# EAGLE design PlingPlong (EAGLE 6.4)

## Sheet 1 of 3
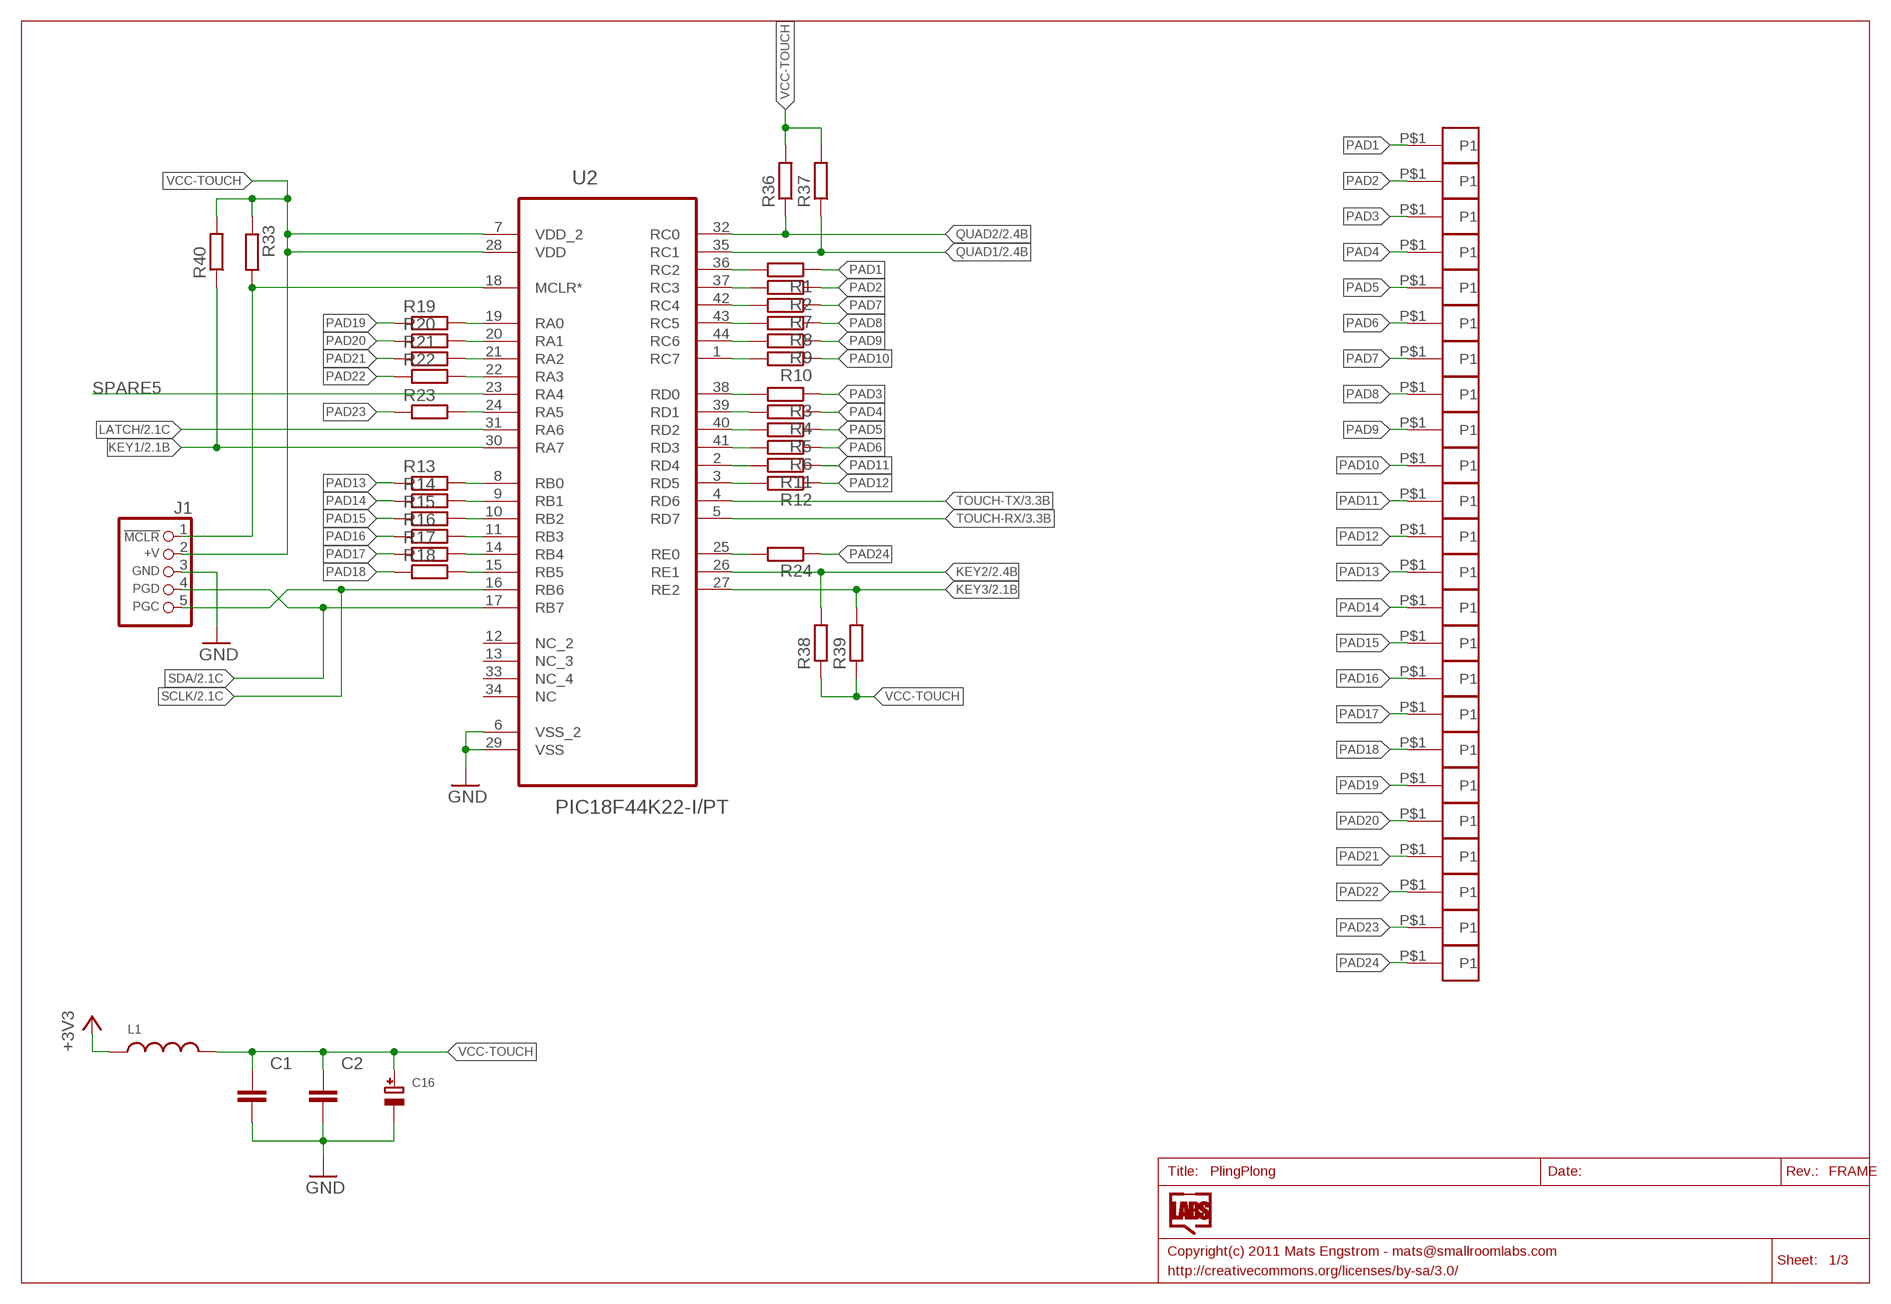
[diagram p0: schematic, sheet 1]

### Parts
C1  CAPACITOR_NPOL-0805  [C805]
C2  CAPACITOR_NPOL-0805  [C805]
C16  CAP_TANTALUMD/7343_WAVE  [EIA7343-31/D-W]
J1  CON_HEADER_PRG_PIC_ICSPB  [HEADER_PRG_1X05_ICSP_B]
L1  INDUCTOR0805  [0805]
P1  PAD-NOSTOP  [PAD1X1NOSTOP]
P2  PAD-NOSTOP  [PAD1X1NOSTOP]
P3  PAD-NOSTOP  [PAD1X1NOSTOP]
P4  PAD-NOSTOP  [PAD1X1NOSTOP]
P5  PAD-NOSTOP  [PAD1X1NOSTOP]
P6  PAD-NOSTOP  [PAD1X1NOSTOP]
P7  PAD-NOSTOP  [PAD1X1NOSTOP]
P8  PAD-NOSTOP  [PAD1X1NOSTOP]
P9  PAD-NOSTOP  [PAD1X1NOSTOP]
P10  PAD-NOSTOP  [PAD1X1NOSTOP]
P11  PAD-NOSTOP  [PAD1X1NOSTOP]
P12  PAD-NOSTOP  [PAD1X1NOSTOP]
P13  PAD-NOSTOP  [PAD1X1NOSTOP]
P14  PAD-NOSTOP  [PAD1X1NOSTOP]
P15  PAD-NOSTOP  [PAD1X1NOSTOP]
P16  PAD-NOSTOP  [PAD1X1NOSTOP]
P17  PAD-NOSTOP  [PAD1X1NOSTOP]
P18  PAD-NOSTOP  [PAD1X1NOSTOP]
P19  PAD-NOSTOP  [PAD1X1NOSTOP]
P20  PAD-NOSTOP  [PAD1X1NOSTOP]
P21  PAD-NOSTOP  [PAD1X1NOSTOP]
P22  PAD-NOSTOP  [PAD1X1NOSTOP]
P23  PAD-NOSTOP  [PAD1X1NOSTOP]
P24  PAD-NOSTOP  [PAD1X1NOSTOP]
R1  R-EU_R0805W  [R0805W]
R2  R-EU_R0805W  [R0805W]
R3  R-EU_R0805W  [R0805W]
R4  R-EU_R0805W  [R0805W]
R5  R-EU_R0805W  [R0805W]
R6  R-EU_R0805W  [R0805W]
R7  R-EU_R0805W  [R0805W]
R8  R-EU_R0805W  [R0805W]
R9  R-EU_R0805W  [R0805W]
R10  R-EU_R0805W  [R0805W]
R11  R-EU_R0805W  [R0805W]
R12  R-EU_R0805W  [R0805W]
R13  R-EU_R0805W  [R0805W]
R14  R-EU_R0805W  [R0805W]
R15  R-EU_R0805W  [R0805W]
R16  R-EU_R0805W  [R0805W]
R17  R-EU_R0805W  [R0805W]
R18  R-EU_R0805W  [R0805W]
R19  R-EU_R0805W  [R0805W]
R20  R-EU_R0805W  [R0805W]
R21  R-EU_R0805W  [R0805W]
R22  R-EU_R0805W  [R0805W]
R23  R-EU_R0805W  [R0805W]
R24  R-EU_R0805W  [R0805W]
R33  R-EU_R0805W  [R0805W]
R36  R-EU_R0805W  [R0805W]
R37  R-EU_R0805W  [R0805W]
R38  R-EU_R0805W  [R0805W]
R39  R-EU_R0805W  [R0805W]
R40  R-EU_R0805W  [R0805W]
U2  PIC18F44K22-I/PT  [QFP80P1200X1200X120-44N]

### Nets
+3V3: L1.1 ; also sheet 2,3
GND: C1.2 C2.2 C16.- J1.3(GND) U2.6(VSS_2) U2.29(VSS) ; also sheet 2,3
KEY1: R40.1 U2.30(RA7) ; also sheet 2
KEY2: R38.2 U2.26(RE1) ; also sheet 2
KEY3: R39.2 U2.27(RE2) ; also sheet 2
LATCH: U2.31(RA6) ; also sheet 2
N$1: R13.2 U2.8(RB0)
N$2: R14.2 U2.9(RB1)
N$3: R15.2 U2.10(RB2)
N$4: R16.2 U2.11(RB3)
N$5: R17.2 U2.14(RB4)
N$6: R18.2 U2.15(RB5)
N$7: R23.2 U2.24(RA5)
N$8: R19.2 U2.19(RA0)
N$9: R20.2 U2.20(RA1)
N$10: R21.2 U2.21(RA2)
N$11: R22.2 U2.22(RA3)
N$14: R1.2 U2.36(RC2)
N$15: R2.2 U2.37(RC3)
N$16: R7.2 U2.42(RC4)
N$17: R8.2 U2.43(RC5)
N$18: R9.2 U2.44(RC6)
N$19: R10.2 U2.1(RC7)
N$20: R24.2 U2.25(RE0)
N$22: J1.1(/MCLR) R33.2 U2.18(MCLR*)
N$23: R12.2 U2.3(RD5)
N$24: R11.2 U2.2(RD4)
N$25: R6.2 U2.41(RD3)
N$26: R5.2 U2.40(RD2)
N$27: R4.2 U2.39(RD1)
N$28: R3.2 U2.38(RD0)
PAD1: P1.P$1(P1) R1.1
PAD2: P2.P$1(P1) R2.1
PAD3: P3.P$1(P1) R3.1
PAD4: P4.P$1(P1) R4.1
PAD5: P5.P$1(P1) R5.1
PAD6: P6.P$1(P1) R6.1
PAD7: P7.P$1(P1) R7.1
PAD8: P8.P$1(P1) R8.1
PAD9: P9.P$1(P1) R9.1
PAD10: P10.P$1(P1) R10.1
PAD11: P11.P$1(P1) R11.1
PAD12: P12.P$1(P1) R12.1
PAD13: P13.P$1(P1) R13.1
PAD14: P14.P$1(P1) R14.1
PAD15: P15.P$1(P1) R15.1
PAD16: P16.P$1(P1) R16.1
PAD17: P17.P$1(P1) R17.1
PAD18: P18.P$1(P1) R18.1
PAD19: P19.P$1(P1) R19.1
PAD20: P20.P$1(P1) R20.1
PAD21: P21.P$1(P1) R21.1
PAD22: P22.P$1(P1) R22.1
PAD23: P23.P$1(P1) R23.1
PAD24: P24.P$1(P1) R24.1
QUAD1: R37.1 U2.35(RC1) ; also sheet 2
QUAD2: R36.1 U2.32(RC0) ; also sheet 2
SCLK: J1.5(PGC) U2.16(RB6) ; also sheet 2
SDA: J1.4(PGD) U2.17(RB7) ; also sheet 2
SPARE5: U2.23(RA4)
TOUCH-RX: U2.5(RD7) ; also sheet 3
TOUCH-TX: U2.4(RD6) ; also sheet 3
VCC-TOUCH: C1.1 C2.1 C16.+ J1.2(+V) L1.2 R33.1 R36.2 R37.2 R38.1 R39.1 R40.2 U2.7(VDD_2) U2.28(VDD)
Unconnected: U2.12(NC_2) U2.13(NC_3) U2.33(NC_4) U2.34(NC)

## Sheet 2 of 3
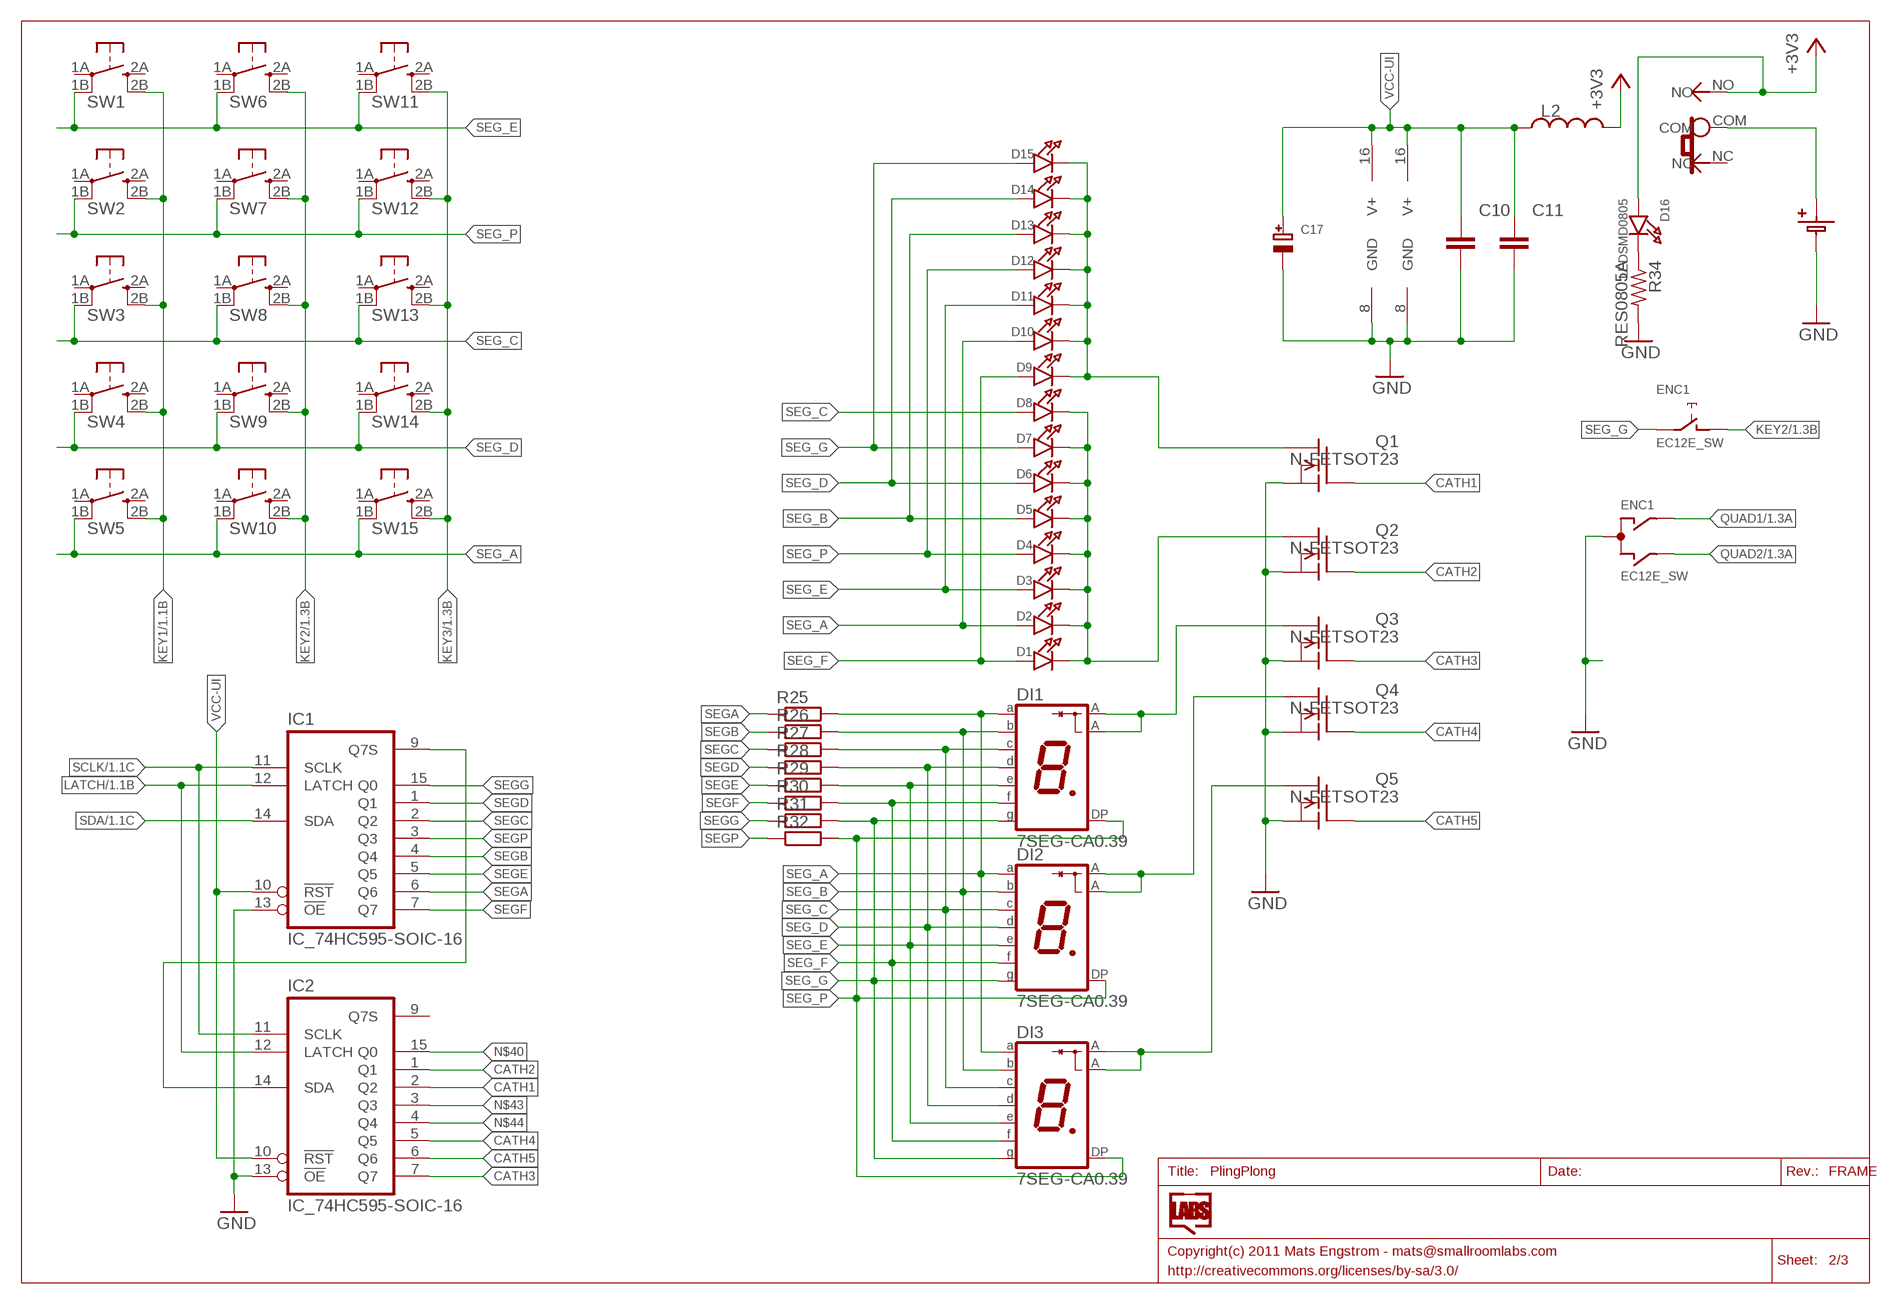
[diagram p1: schematic, sheet 2]

### Parts
BA1  BATTERY1-123PIN  [BATTERY-CR123A-PINS]
C10  CAPACITOR_NPOL-0805  [C805]
C11  CAPACITOR_NPOL-0805  [C805]
C17  CAP_TANTALUMD/7343_WAVE  [EIA7343-31/D-W]
D1  LED3MM  [LED3MM]
D2  LED3MM  [LED3MM]
D3  LED3MM  [LED3MM]
D4  LED3MM  [LED3MM]
D5  LED3MM  [LED3MM]
D6  LED3MM  [LED3MM]
D7  LED3MM  [LED3MM]
D8  LED3MM  [LED3MM]
D9  LED3MM  [LED3MM]
D10  LED3MM  [LED3MM]
D11  LED3MM  [LED3MM]
D12  LED3MM  [LED3MM]
D13  LED3MM  [LED3MM]
D14  LED3MM  [LED3MM]
D15  LED3MM  [LED3MM]
D16  LEDSMD0805  [CHIPLED_0805]
DI1  7SEG-CA0.39  [LG3911]
DI2  7SEG-CA0.39  [LG3911]
DI3  7SEG-CA0.39  [LG3911]
ENC1  EC12E_SW  [ALPS_EC12E_SW]
IC1  IC_74HC595-SOIC-16  [SOIC-16]
IC2  IC_74HC595-SOIC-16  [SOIC-16]
L2  INDUCTOR0805  [0805]
Q1  N-FETSOT23  [SOT23]
Q2  N-FETSOT23  [SOT23]
Q3  N-FETSOT23  [SOT23]
Q4  N-FETSOT23  [SOT23]
Q5  N-FETSOT23  [SOT23]
R25  R-EU_R0805W  [R0805W]
R26  R-EU_R0805W  [R0805W]
R27  R-EU_R0805W  [R0805W]
R28  R-EU_R0805W  [R0805W]
R29  R-EU_R0805W  [R0805W]
R30  R-EU_R0805W  [R0805W]
R31  R-EU_R0805W  [R0805W]
R32  R-EU_R0805W  [R0805W]
R34  RES0805A  [R0805A]
SW1  TACTILETACT-6X6-PTH  [TACTILE-PTH]
SW2  TACTILETACT-6X6-PTH  [TACTILE-PTH]
SW3  TACTILETACT-6X6-PTH  [TACTILE-PTH]
SW4  TACTILETACT-6X6-PTH  [TACTILE-PTH]
SW5  TACTILETACT-6X6-PTH  [TACTILE-PTH]
SW6  TACTILETACT-6X6-PTH  [TACTILE-PTH]
SW7  TACTILETACT-6X6-PTH  [TACTILE-PTH]
SW8  TACTILETACT-6X6-PTH  [TACTILE-PTH]
SW9  TACTILETACT-6X6-PTH  [TACTILE-PTH]
SW10  TACTILETACT-6X6-PTH  [TACTILE-PTH]
SW11  TACTILETACT-6X6-PTH  [TACTILE-PTH]
SW12  TACTILETACT-6X6-PTH  [TACTILE-PTH]
SW13  TACTILETACT-6X6-PTH  [TACTILE-PTH]
SW14  TACTILETACT-6X6-PTH  [TACTILE-PTH]
SW15  TACTILETACT-6X6-PTH  [TACTILE-PTH]
SW16  SLIDESWITCH-PCM12  [PCM12]

### Nets
+3V3: D16.A L2.2 SW16.NO ; also sheet 1,3
CATH1: IC2.2(Q2) Q1.1(G)
CATH2: IC2.1(Q1) Q2.1(G)
CATH3: IC2.7(Q7) Q3.1(G)
CATH4: IC2.5(Q5) Q4.1(G)
CATH5: IC2.6(Q6) Q5.1(G)
CATH_1: D9.C D10.C D11.C D12.C D13.C D14.C D15.C Q1.3(D)
CATH_2: D1.C D2.C D3.C D4.C D5.C D6.C D7.C D8.C Q2.3(D)
CATH_3: DI1.P$3(A) DI1.P$8(A) Q3.3(D)
CATH_4: DI2.P$3(A) DI2.P$8(A) Q4.3(D)
CATH_5: DI3.P$3(A) DI3.P$8(A) Q5.3(D)
GND: BA1.NEG C10.2 C11.2 C17.- ENC1.C IC1.8(GND) IC1.13(!OE) IC2.8(GND) IC2.13(!OE) Q1.2(S) Q2.2(S) Q3.2(S) Q4.2(S) Q5.2(S) R34.2 ; also sheet 1,3
KEY1: SW1.2B SW2.2B SW3.2B SW4.2B SW5.2B ; also sheet 1
KEY2: ENC1.D SW6.2B SW7.2B SW8.2B SW9.2B SW10.2B ; also sheet 1
KEY3: SW11.2B SW12.2B SW13.2B SW14.2B SW15.2B ; also sheet 1
LATCH: IC1.12(LATCH) IC2.12(LATCH) ; also sheet 1
N$31: IC1.9(Q7S) IC2.14(SDA)
N$33: BA1.POS(POS1) SW16.COM
N$34: D16.C R34.1
N$40: IC2.15(Q0)
N$43: IC2.3(Q3)
N$44: IC2.4(Q4)
QUAD1: ENC1.A ; also sheet 1
QUAD2: ENC1.B ; also sheet 1
SCLK: IC1.11(SCLK) IC2.11(SCLK) ; also sheet 1
SDA: IC1.14(SDA) ; also sheet 1
SEG_A: D2.A D10.A DI1.P$10(A) DI2.P$10(A) DI3.P$10(A) R25.2 SW5.1B SW10.1B SW15.1B
SEG_B: D5.A D13.A DI1.P$9(B) DI2.P$9(B) DI3.P$9(B) R26.2
SEG_C: D8.A DI1.P$7(C) DI2.P$7(C) DI3.P$7(C) R27.2 SW3.1B SW8.1B SW13.1B
SEG_D: D6.A D14.A DI1.P$5(D) DI2.P$5(D) DI3.P$5(D) R28.2 SW4.1B SW9.1B SW14.1B
SEG_E: D3.A D11.A DI1.P$2(E) DI2.P$2(E) DI3.P$2(E) R29.2 SW1.1B SW6.1B SW11.1B
SEG_F: D1.A D9.A DI1.P$1(F) DI2.P$1(F) DI3.P$1(F) R30.2
SEG_G: D7.A D15.A DI1.P$6(G) DI2.P$6(G) DI3.P$6(G) ENC1.E R31.2
SEG_P: D4.A D12.A DI1.P$4(DP) DI2.P$4(DP) DI3.P$4(DP) R32.2 SW2.1B SW7.1B SW12.1B
SEGA: IC1.6(Q6) R25.1
SEGB: IC1.4(Q4) R26.1
SEGC: IC1.2(Q2) R27.1
SEGD: IC1.1(Q1) R28.1
SEGE: IC1.5(Q5) R29.1
SEGF: IC1.7(Q7) R30.1
SEGG: IC1.15(Q0) R31.1
SEGP: IC1.3(Q3) R32.1
VCC-UI: C10.1 C11.1 C17.+ IC1.10(!RST) IC1.16(V+) IC2.10(!RST) IC2.16(V+) L2.1
Unconnected: ENC1.GND1(G) ENC1.GND2(G) IC2.9(Q7S) SW1.1A SW1.2A SW2.1A SW2.2A SW3.1A SW3.2A SW4.1A SW4.2A SW5.1A SW5.2A SW6.1A SW6.2A SW7.1A SW7.2A SW8.1A SW8.2A SW9.1A SW9.2A SW10.1A SW10.2A SW11.1A SW11.2A SW12.1A SW12.2A SW13.1A SW13.2A SW14.1A SW14.2A SW15.1A SW15.2A SW16.NC

## Sheet 3 of 3
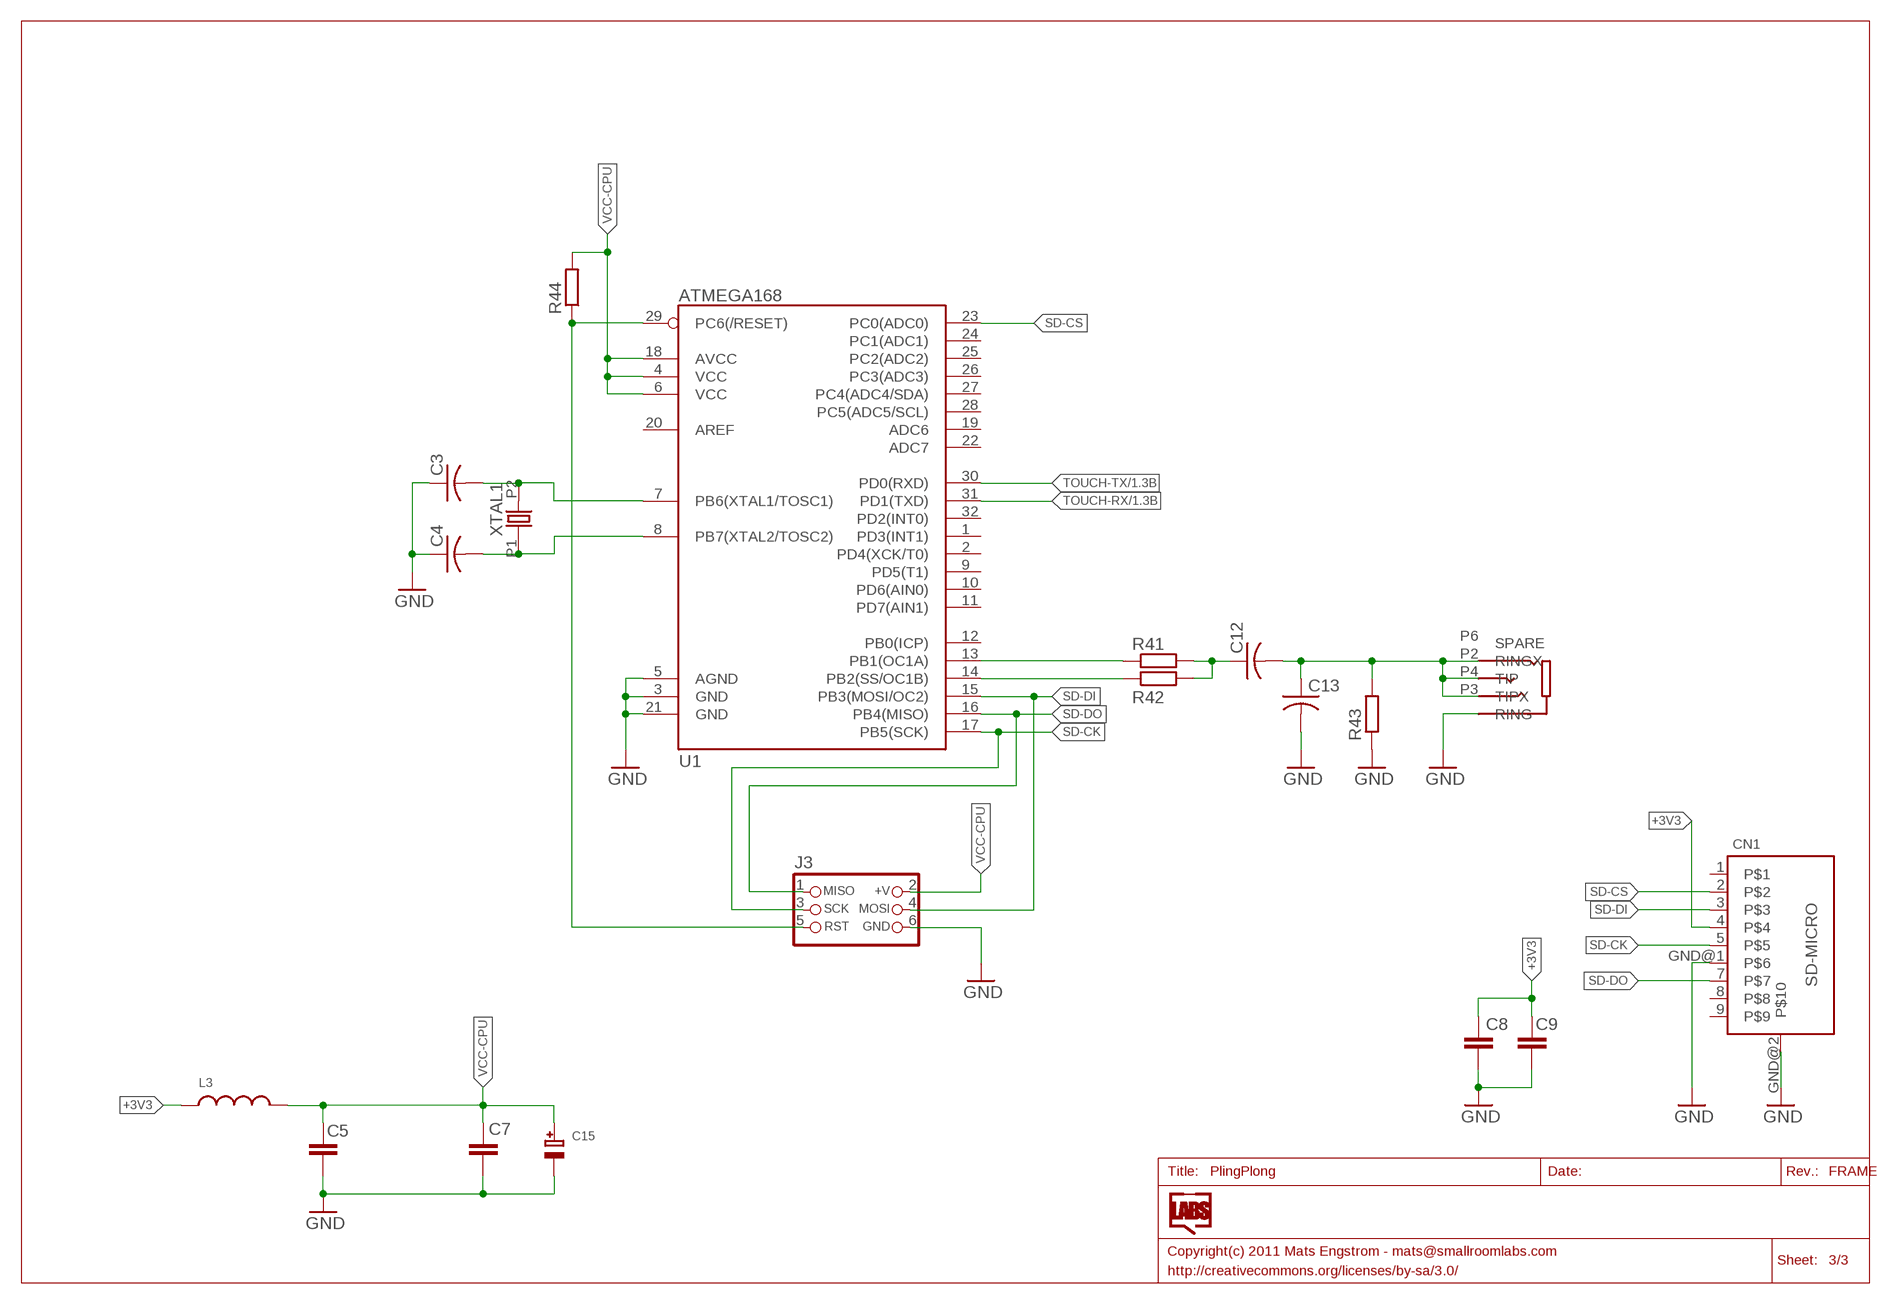
[diagram p2: schematic, sheet 3]

### Parts
C3  C-USC0805  [C0805]
C4  C-USC0805  [C0805]
C5  CAPACITOR_NPOL-0805  [C805]
C7  CAPACITOR_NPOL-0805  [C805]
C8  CAPACITOR_NPOL-0805  [C805]
C9  CAPACITOR_NPOL-0805  [C805]
C12  C-USC1206  [C1206]
C13  C-USC0805  [C0805]
C15  CAP_TANTALUMD/7343_WAVE  [EIA7343-31/D-W]
CN1  SD-MICRO  [MICROSD-TFP09]
J3  CON_HEADER_PRG_AVR_ICSP  [HEADER_PRG_2X03]
L3  INDUCTOR0805  [0805]
R41  R-EU_R0805W  [R0805W]
R42  R-EU_R0805W  [R0805W]
R43  R-EU_R0805W  [R0805W]
R44  R-EU_R0805W  [R0805W]
U1  ATMEGA168  [TQFP32-08]
U$2  JACK4-PJ320  [PJ-320E]
XTAL1  OSC-XTAL-HC-49U-PTH  [HC-49U-PTH]

### Nets
+3V3: C8.1 C9.1 CN1.4 L3.1 ; also sheet 1,2
CPU-RESET: J3.5(RST) R44.1 U1.29(PC6(/RESET))
GND: C3.1 C4.1 C5.2 C7.2 C8.2 C9.2 C13.2 C15.- CN1.GND@1 CN1.GND@2 J3.6(GND) R43.1 U1.3(GND) U1.5(AGND) U1.21(GND) U$2.P5(RING) ; also sheet 1,2
N$12: R41.1 U1.13(PB1(OC1A))
N$13: R42.1 U1.14(PB2(SS/OC1B))
N$21: C12.1 R41.2 R42.2
N$29: C12.2 C13.1 R43.2 U$2.P2(RINGX) U$2.P3(TIPX) U$2.P4(TIP)
N$30: C3.2 U1.7(PB6(XTAL1/TOSC1)) XTAL1.P2
N$32: C4.2 U1.8(PB7(XTAL2/TOSC2)) XTAL1.P1
SD-CK: CN1.5 J3.3(SCK) U1.17(PB5(SCK))
SD-CS: CN1.2 U1.23(PC0(ADC0))
SD-DI: CN1.3 J3.4(MOSI) U1.15(PB3(MOSI/OC2))
SD-DO: CN1.7 J3.1(MISO) U1.16(PB4(MISO))
TOUCH-RX: U1.31(PD1(TXD)) ; also sheet 1
TOUCH-TX: U1.30(PD0(RXD)) ; also sheet 1
VCC-CPU: C5.1 C7.1 C15.+ J3.2(+V) L3.2 R44.2 U1.4(VCC) U1.6(VCC) U1.18(AVCC)
Unconnected: CN1.1 CN1.8 CN1.9 U1.1(PD3(INT1)) U1.2(PD4(XCK/T0)) U1.9(PD5(T1)) U1.10(PD6(AIN0)) U1.11(PD7(AIN1)) U1.12(PB0(ICP)) U1.19(ADC6) U1.20(AREF) U1.22(ADC7) U1.24(PC1(ADC1)) U1.25(PC2(ADC2)) U1.26(PC3(ADC3)) U1.27(PC4(ADC4/SDA)) U1.28(PC5(ADC5/SCL)) U1.32(PD2(INT0)) U$2.P6(SPARE)

## Library data of the parts
BA1 = SmallRoomLabs:BATTERY1
C1 C2 C5 C7-C11 = dp_devices:CAPACITOR_NPOL: Non-Polarized capacitor in various packages
C3 C4 C12 C13 = rcl:C-US: CAPACITOR, American symbol
C15-C17 = microbuilder:CAP_TANTALUM: Tantalum Capacitors Wave footprints have larger pads and are meant to be used for hand soldering. Reflow footprints are optimised for solder paste and a reflow oven. EIA3216-18/A-[R/W] - Size A / 3216-18 / 1206 footprint 4.7µF 25V 10% Tantalum Capacitor 10µF 16V 10% Tantalum Capacitor [Digikey: 495-2236-2-ND] EIA3528-21/B-[R/W] - Size B / 3528-21 47µF 10V 10% Tantalum Capactior [Digikey: 495-2216-1-ND] EIA6032-28/C-[R/W] - Size C / 6032-28 10µF 35V 20% Tantalum Capacitor [Digikey: 495-2285-1-ND] 100µF 16V 10% Tantalum Capactior [Digikey: 399-5214-1-ND]
CN1 = SmallRoomLabs:SD-MICRO
D1-D16 = SmallRoomLabs:LED
DI1-DI3 = SmallRoomLabs:7SEG-CA
ENC1 = switch-alps:EC12E_SW: ALPS rotary Encoder EC12E series with switch; MPN: EC12E2424407; OC_FARNELL: 1520813; OC_NEWARK: 74M1068
IC1 IC2 = dp_devices:IC_74HC595: 8-bit serial-in parallel out shift register, output latch 3-state
J1 = dp_devices:CON_HEADER_PRG_PIC_ICSP: 5-pin PIC In Circuit Serial Programming header
J3 = dp_devices:CON_HEADER_PRG_AVR_ICSP: 2x3 AVR ICSP programming header
L1-L3 = microbuilder:INDUCTOR: Inductors 0603: 10nH Ceramic Inductor - microwire antenna/RF (Digikey: 712-1434-2-ND) 0805: 560nH Ceramic Inductor - RF (Digikey: 553-1047-1-ND) 1007 (2518 Metric) SMT: 10µH 10% 250mOhm 820mA 1007 Inductor (Digikey: 587-2189-1-ND) 22µH 10% 500mOhm 580mA 1007 Inductor (Digikey: 587-2190-1-ND) 47µH 10% 950mOhm 420mA 1007 Inductor (Digikey: 587-2191-1-ND) 47µH 5% 100mOhm 1A 1008 Inductor (Digikey: 732-1816-1-ND)
P1-P24 = SmallRoomLabs:PAD
Q1-Q5 = SmallRoomLabs:N-FET
R1-R33 R36-R44 = rcl:R-EU_: RESISTOR, European symbol
R34 = SmallRoomLabs:RES
SW1-SW15 = SmallRoomLabs:TACTILE
SW16 = SmallRoomLabs:SLIDESWITCH
U1 = SparkFun:ATMEGA168
U2 = SmallRoomLabs:PIC18F44K22-I/PT: IC PIC MCU 16KB FLASH 44TQFP; MPN: PIC18F44K22-I/PT; OC_FARNELL: 1814966; OC_NEWARK: 73R8569; PACKAGE: TQFP-44; SUPPLIER: Microchip
U$2 = SmallRoomLabs:JACK4
XTAL1 = dp_devices:OSC-XTAL

## Board
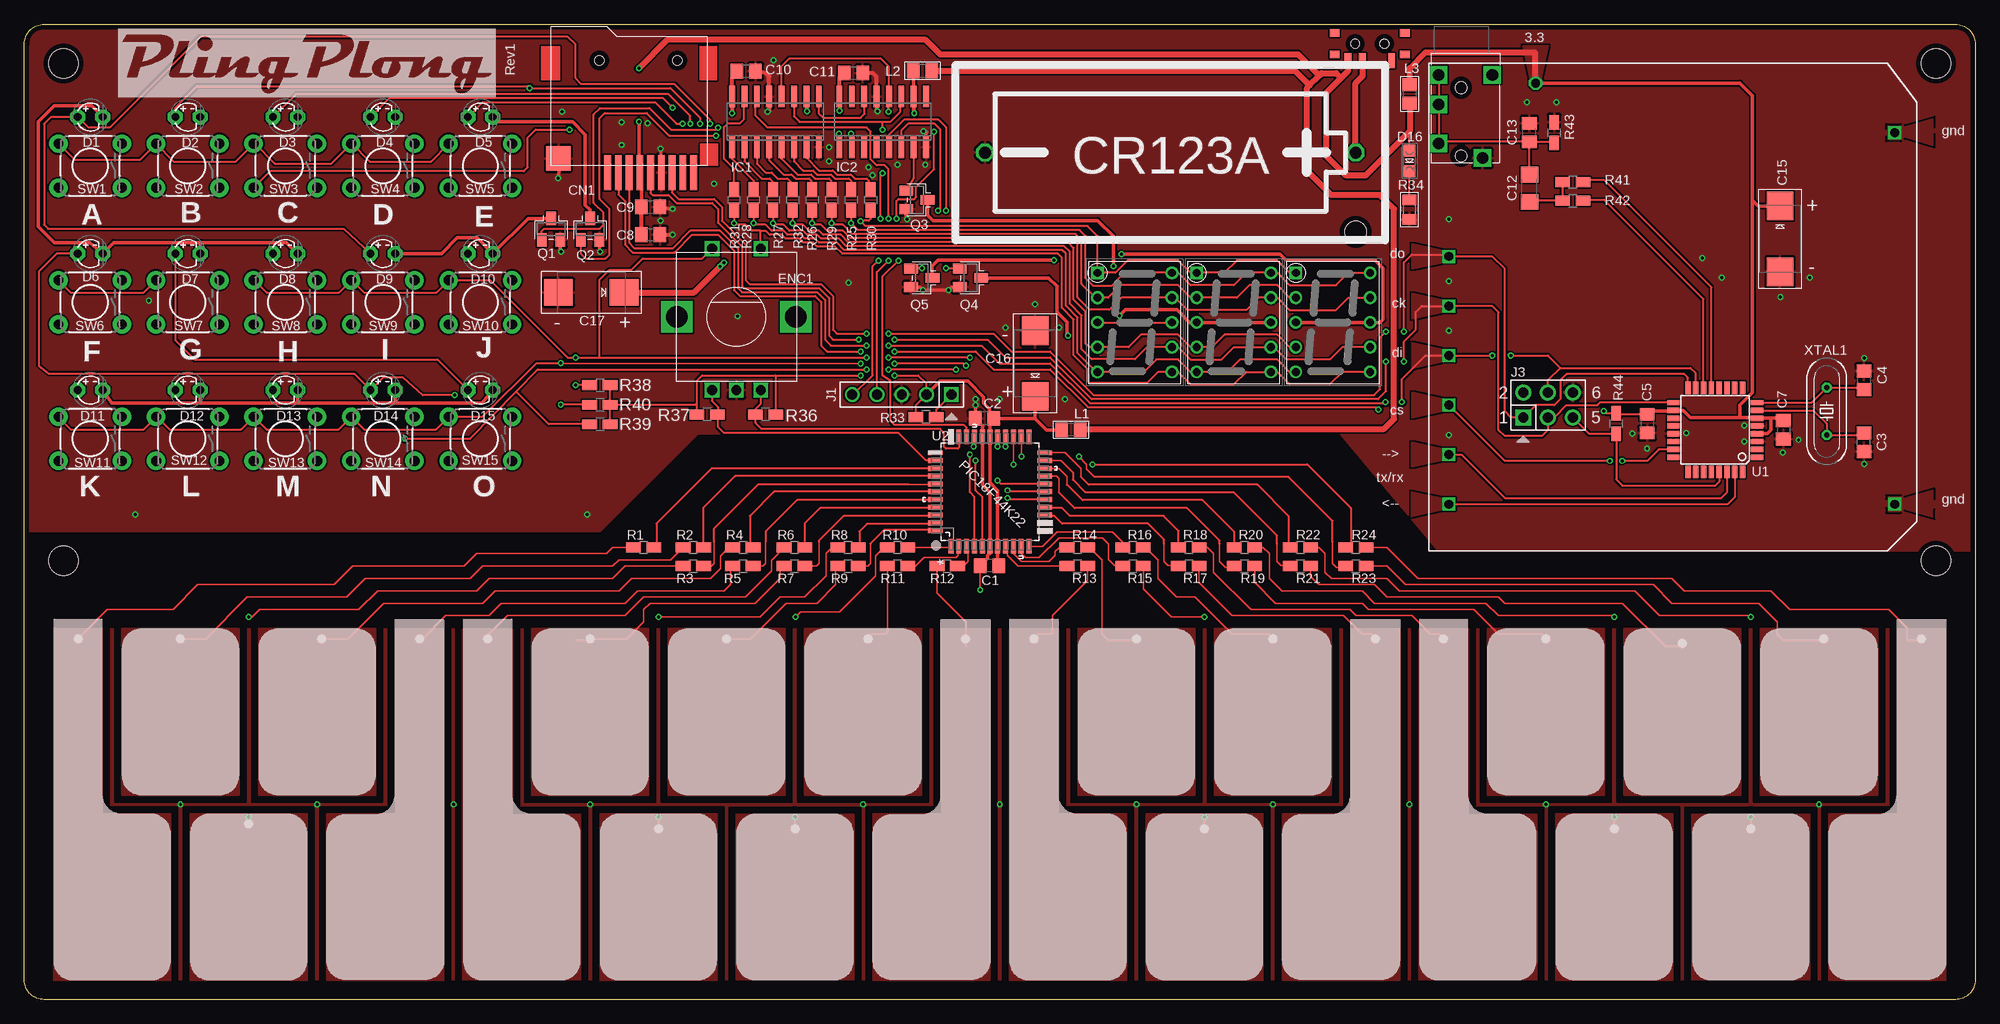
[diagram p3: board, top side]
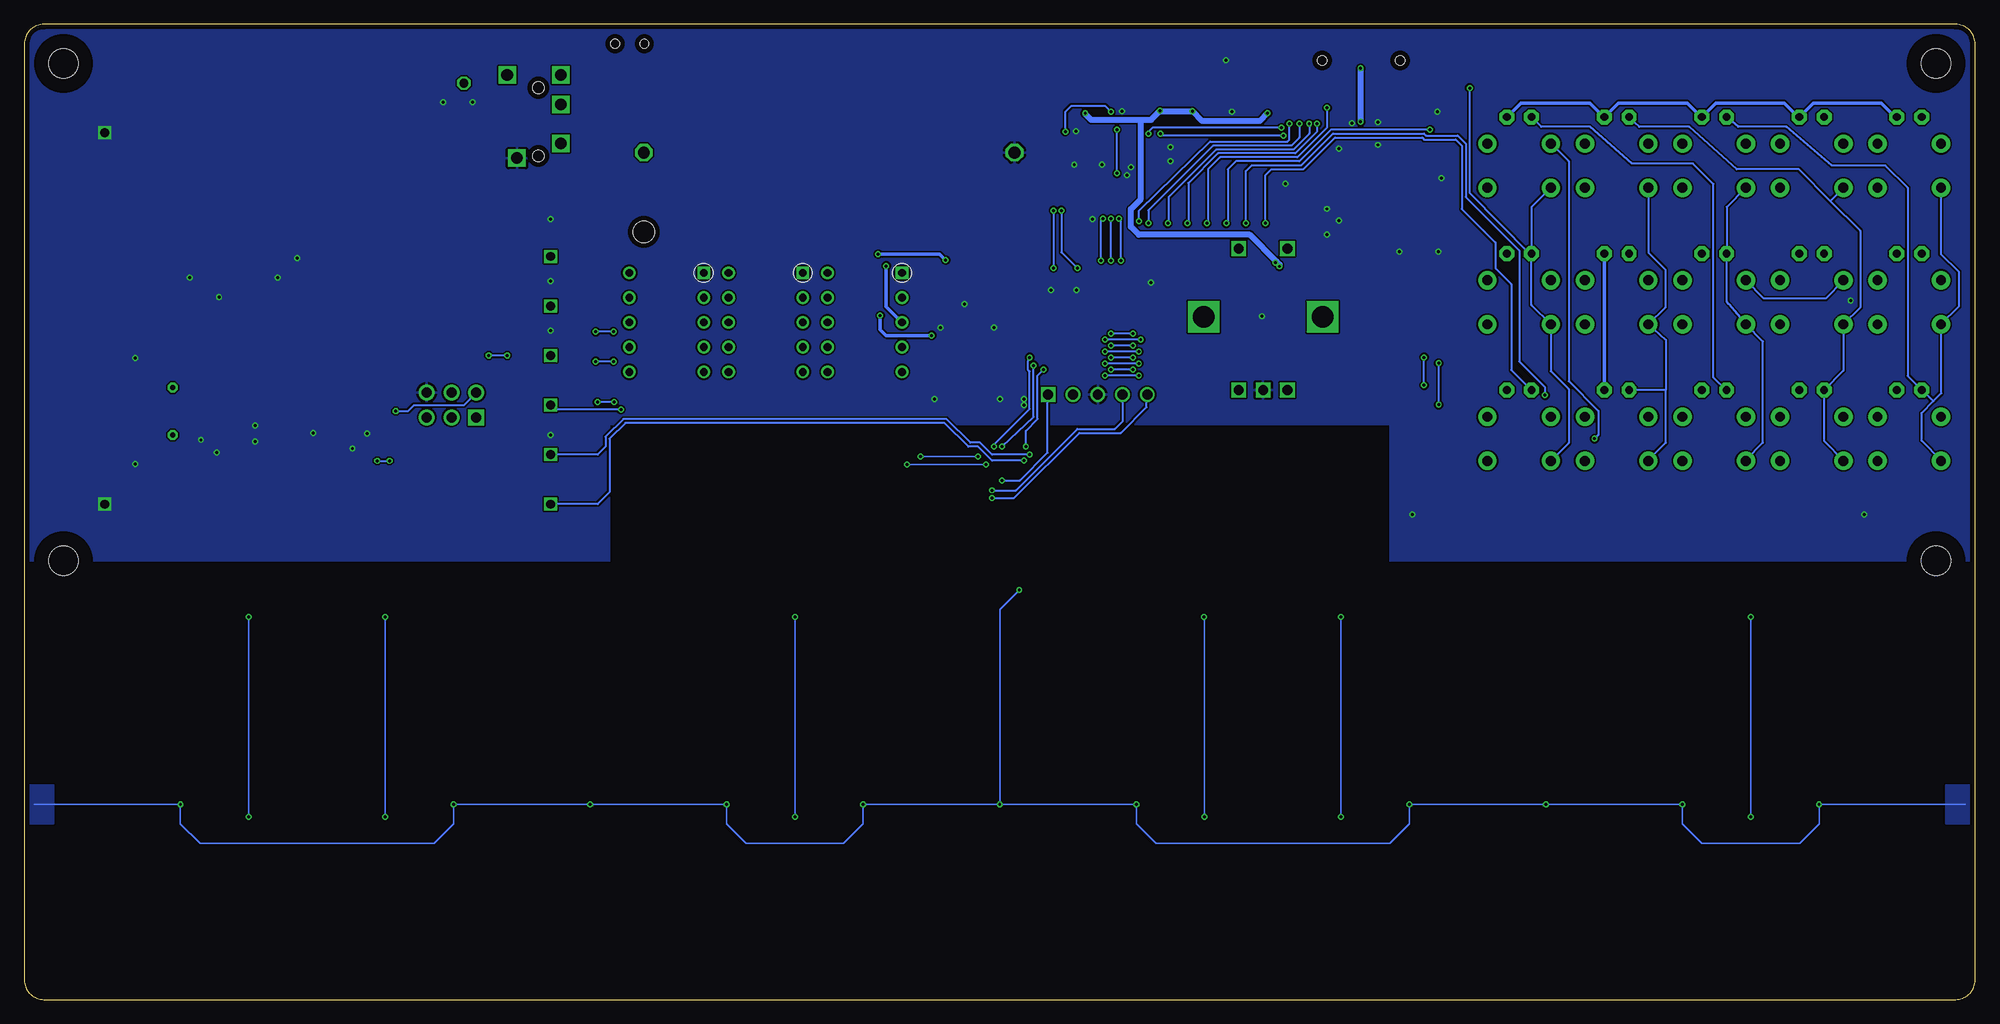
[diagram p4: board, bottom side, seen from below]

Size 200 x 100 mm. Coordinates in mm from the lower left corner, seen from the top.
Outline: 0,98 arc-90 2,100 198,100 arc-90 200,98 200,2 arc-90 198,0 2,0 arc-90 0,2 0,98
Copper layers (1*16): Top 0.035mm / dielectric 1.5mm / Bottom 0.035mm
Design rules "SmartPrototyping": minimum track width 7mil, minimum drill 12mil, track to track 7mil, track to pad 7mil, pad to pad 7mil, via to via 7mil, smd to smd 0mil, copper to edge 20mil, drill to drill 10mil, minimum pad ring 10mil, minimum via ring 6mil, stop-mask expansion 2mil, vias tented up to drill 25mil, thermal gap 10mil
Holes 3 mm at 196,96 4,96 196,45 4,45
tRestrict: 16 lines
bRestrict: area 1,93 to 7,99; area 193,93 to 199,99; area 193,42 to 199,48; area 1,42 to 7,48

### Footprints (pad centres in the part's own frame; a part is rotated, then mirrored left to right if it is on the bottom)
BATTERY-CR123A-PINS = drill 1.2 octagon: NEG 19,0; POS -19,0 | hole 2.2: -19,8.128
C805 = smd 1.3 x 1.5: 1 -0.95,0; 2 0.95,0
C0805 = smd 1.3 x 1.5: 1 -0.95,0; 2 0.95,0
C1206 = smd 1.6 x 1.8: 1 -1.4,0; 2 1.4,0
EIA7343-31/D-W = smd 2.95 x 2.7: + 3.375,0; - -3.375,0
MICROSD-TFP09 = smd 0.7 x 3.6: 1 2.2,0.2; 2 1.1,0.2; 3 0,0.2; 4 -1.1,0.2; 5 -2.2,0.2; 7 -4.4,0.2; 8 -5.5,0.2; 9 -6.6,0.2; GND@1 -3.3,0.2 | smd 2.5 x 2.5: GND@2 7.25,-1.25 | hole 1: -4.95,-11.3; 3.05,-11.3
LED3MM = drill 0.8 pad 1.524 octagon: A -1.27,0; C 1.27,0
CHIPLED_0805 = smd 1.2 x 1.2: A 0,-1.05; C 0,1.05
LG3911 = drill 0.8 square: P$1 -3.81,5.08 | drill 0.8: P$2 -3.81,2.54; P$3 -3.81,0; P$4 -3.81,-2.54; P$5 -3.81,-5.08; P$6 3.81,-5.08; P$7 3.81,-2.54; P$8 3.81,0; P$9 3.81,2.54; P$10 3.81,5.08
ALPS_EC12E_SW = drill 1 square: A -2.5,-7.5; B 2.5,-7.5; C 0,-7.5; D -2.5,7; E 2.5,7 | drill 2.2 square: GND1 -6.1,0; GND2 6.1,0
SOIC-16 = smd 0.6 x 2.2: 1 -4.445,-2.6; 2 -3.175,-2.6; 3 -1.905,-2.6; 4 -0.635,-2.6; 5 0.635,-2.6; 6 1.905,-2.6; 7 3.175,-2.6; 8 4.445,-2.6; 9 4.445,2.6; 10 3.175,2.6; 11 1.905,2.6; 12 0.635,2.6; 13 -0.635,2.6; 14 -1.905,2.6; 15 -3.175,2.6; 16 -4.445,2.6
HEADER_PRG_1X05_ICSP_B = drill 1.016 square: 1 -5.08,0 | drill 1.016: 2 -2.54,0; 3 0,0; 4 2.54,0; 5 5.08,0
HEADER_PRG_2X03 = drill 1.02 pad 1.632 square: 1 -2.54,-1.27 | drill 1.02 pad 1.632: 2 -2.54,1.27; 3 0,-1.27; 4 0,1.27; 5 2.54,-1.27; 6 2.54,1.27
0805 = smd 1.3 x 1.5: 1 -0.95,0; 2 0.95,0
PAD1X1NOSTOP = smd 1 x 1: P$1 0,0
SOT23 = smd 1 x 1.4: 1 -0.95,-1.1; 2 0.95,-1.1; 3 0,1.1
R0805W = smd 1.5 x 1: 1 -1.052,0; 2 1.052,0
R0805A = smd 1.1 x 1.4: 1 -1,0; 2 1,0
TACTILE-PTH = drill 1.016 pad 1.88: 1A -3.251,2.261; 1B 3.251,2.261; 2A -3.251,-2.261; 2B 3.251,-2.261
PCM12 = smd 0.7 x 1.5: COM 0.75,1.75; NC -2.25,1.75; NO 2.25,1.75 | smd 1 x 0.8: P$1 -3.6,-1.1; P$2 -3.6,1.1; P$3 3.6,1.1; P$4 3.6,-1.1 | hole 0.9: -1.5,0; 1.5,0
TQFP32-08 = smd 1.27 x 0.559: 1 -4.293,2.8; 2 -4.293,2; 3 -4.293,1.2; 4 -4.293,0.4; 5 -4.293,-0.4; 6 -4.293,-1.2; 7 -4.293,-2; 8 -4.293,-2.8; 17 4.293,-2.8; 18 4.293,-2; 19 4.293,-1.2; 20 4.293,-0.4; 21 4.293,0.4; 22 4.293,1.2; 23 4.293,2; 24 4.293,2.8 | smd 0.559 x 1.27: 9 -2.8,-4.293; 10 -2,-4.293; 11 -1.2,-4.293; 12 -0.4,-4.293; 13 0.4,-4.293; 14 1.2,-4.293; 15 2,-4.293; 16 2.8,-4.293; 25 2.8,4.293; 26 2,4.293; 27 1.2,4.293; 28 0.4,4.293; 29 -0.4,4.293; 30 -1.2,4.293; 31 -2,4.293; 32 -2.8,4.293
QFP80P1200X1200X120-44N = smd 1.473 x 0.508: 1 -5.613,3.988; 2 -5.613,3.2; 3 -5.613,2.388; 4 -5.613,1.6; 5 -5.613,0.787; 6 -5.613,0; 7 -5.613,-0.787; 8 -5.613,-1.6; 9 -5.613,-2.388; 10 -5.613,-3.2; 11 -5.613,-3.988; 23 5.613,-3.988; 24 5.613,-3.2; 25 5.613,-2.388; 26 5.613,-1.6; 27 5.613,-0.787; 28 5.613,0; 29 5.613,0.787; 30 5.613,1.6; 31 5.613,2.388; 32 5.613,3.2; 33 5.613,3.988 | smd 0.508 x 1.473: 12 -3.988,-5.613; 13 -3.2,-5.613; 14 -2.388,-5.613; 15 -1.6,-5.613; 16 -0.787,-5.613; 17 0,-5.613; 18 0.787,-5.613; 19 1.6,-5.613; 20 2.388,-5.613; 21 3.2,-5.613; 22 3.988,-5.613; 34 3.988,5.613; 35 3.2,5.613; 36 2.388,5.613; 37 1.6,5.613; 38 0.787,5.613; 39 0,5.613; 40 -0.787,5.613; 41 -1.6,5.613; 42 -2.388,5.613; 43 -3.2,5.613; 44 -3.988,5.613
PJ-320E = drill 1.2 square: P2 2.2,0; P3 5.2,0; P4 9.2,0; P5 10.7,4.5; P6 2.2,5.5 | hole 1.2: 3.5,2.3; 10.5,2.3
HC-49U-PTH = drill 0.508 octagon: P1 -2.44,0; P2 2.44,0

### Placement (x,y rotation side)
BA1  117.49,86.85 180 top
C1  98.96,44.5 180 top
C2  98.42,59.59 180 top
C3  188.59,57.15 90 top
C4  188.59,63.5 270 top
C5  166.37,59.05 270 top
C7  180.34,58.42 270 top
C8  64.21,78.44 0 top
C9  64.21,81.28 0 top
C10  74,95.2 0 top
C11  85,95 0 top
C12  154.31,83.19 90 top
C13  154.31,88.9 90 top
C15  180,78 90 top
C16  103.63,65.23 270 top
C17  58.12,72.52 0 top
CN1  62,85 180 top
D1  6.75,90.5 0 top
D2  16.75,90.5 0 top
D3  26.75,90.5 0 top
D4  36.75,90.5 0 top
D5  46.75,90.5 0 top
D6  6.75,76.5 0 top
D7  16.75,76.5 0 top
D8  26.75,76.5 0 top
D9  36.75,76.5 0 top
D10  46.75,76.5 0 top
D11  6.75,62.5 0 top
D12  16.75,62.5 0 top
D13  26.75,62.5 0 top
D14  36.75,62.5 0 top
D15  46.75,62.5 0 top
D16  142,86 180 top
DI1  113.84,69.44 0 top
DI2  124,69.44 0 top
DI3  134.16,69.44 0 top
ENC1  73,70 0 top
IC1  77,90 0 top
IC2  88,90 0 top
J1  89.95,62.04 180 top
J3  156.21,60.96 0 top
L1  107.31,58.42 180 top
L2  92.08,95.25 0 top
L3  142.04,92.86 90 top
P1  5.5,37 0 top
P2  16,37 0 top
P3  23,18 0 top
P4  30.5,37 0 top
P5  40.5,37 90 top
P6  47.5,37 90 top
P7  58,37 90 top
P8  65,17.5 90 top
P9  72,37 90 top
P10  79,17.5 90 top
P11  86.5,37 90 top
P12  96.5,37 90 top
P13  103.5,37 90 top
P14  114,37 90 top
P15  121,17.5 90 top
P16  128,37 90 top
P17  138.5,37 90 top
P18  145.5,37 90 top
P19  156,37 180 top
P20  163,17.5 180 top
P21  170,36.5 180 top
P22  177,17.5 180 top
P23  184.5,37 90 top
P24  194.5,37 180 top
Q1  54,79 0 top
Q2  58,79 0 top
Q3  91.5,82 270 top
Q4  97,74 270 top
Q5  92,74 270 top
R1  63.5,46.35 0 top
R2  68.58,46.35 0 top
R3  68.58,44.45 0 top
R4  73.66,46.35 0 top
R5  73.66,44.45 0 top
R6  78.94,46.35 0 top
R7  78.94,44.45 0 top
R8  84.45,46.35 0 top
R9  84.45,44.45 0 top
R10  89.53,46.35 0 top
R11  89.53,44.45 0 top
R12  94.61,44.45 0 top
R13  107.95,44.45 180 top
R14  107.95,46.35 180 top
R15  113.67,44.45 180 top
R16  113.67,46.35 180 top
R17  119.38,44.45 180 top
R18  119.38,46.35 180 top
R19  125.09,44.45 180 top
R20  125.09,46.35 180 top
R21  130.81,44.45 180 top
R22  130.81,46.35 180 top
R23  136.53,44.45 180 top
R24  136.53,46.35 180 top
R25  84.76,82 270 top
R26  80.76,82 270 top
R27  76.76,82 270 top
R28  74.76,82 270 top
R29  82.76,82 270 top
R30  86.76,82 270 top
R31  72.76,82 270 top
R32  78.76,82 270 top
R33  92.46,59.74 0 top
R34  142,81 270 top
R36  76,60 0 top
R37  70,60 180 top
R38  59,63 180 top
R39  59,61 180 top
R40  59,59 0 top
R41  158.75,83.82 180 top
R42  158.75,81.92 180 top
R43  156.84,88.9 270 top
R44  163.19,59.05 90 top
SW1  6.75,85.5 180 top
SW2  16.75,85.5 180 top
SW3  26.75,85.5 180 top
SW4  36.75,85.5 180 top
SW5  46.75,85.5 180 top
SW6  6.75,71.5 180 top
SW7  16.75,71.5 180 top
SW8  26.75,71.5 180 top
SW9  36.75,71.5 180 top
SW10  46.75,71.5 180 top
SW11  6.75,57.5 180 top
SW12  16.75,57.5 180 top
SW13  26.75,57.5 180 top
SW14  36.75,57.5 180 top
SW15  46.75,57.5 180 top
SW16  137.94,98.02 180 top
U1  173.35,58.42 180 top
U2  99,52.08 90 top
U$2  145,97 270 top
XTAL1  184.78,60.33 270 top

### Tracks (layer width: path | path; a pad name or v marks a point on that pad's centre or on a via)
+3V3  (via drill 0.3)
  Top 0.203: D16.A 142,89
  Top 0.356: v63,90 63,84.9 CN1.4 63.26,84.64 C9.1 | 108.37,58.52 L1.1
  Top 0.406: C8.1 C9.1
  Top 0.61: L2.2 130.25,95.25 131.75,93.75 | 108.37,58.52 139.4,58.52 140.41,59.54 140.41,81.09 139,82.5 134,82.5 131.5,85 131.5,93.5 131.75,93.75 | v63,95.5 65.91,98.41 92.4,98.41 93.88,96.93 130.57,96.93 132.75,94.75 | L3.1 142.04,89.04 142,89 137.5,84.5 135.5,84.5 133.5,86.5 133.5,93 135,94.5 | 135,94.5 135.69,95.19 SW16.NO | 131.75,93.75 132.75,94.75 | 132.75,94.75 133,95 134.5,95 135,94.5
  Bottom 0.61: v63,95.5 v63,90
CATH1  (via drill 0.3)
  Top 0.203: Q1.1 53.05,78.81 53.29,79.05 58.98,79.05 59.38,79.45 59.38,80.67 58.37,81.69 58.37,90.77 59,91.41 64.09,91.41 66.3,89.2 70.92,89.2 v71.12,89.41 | v84.73,88.8 84.73,87.49 IC2.2
  Bottom 0.203: v71.12,89.41 84.33,89.41 84.73,89 v84.73,88.8
CATH2  (via drill 0.3)
  Top 0.203: Q2.1 57.05,76.5 57.55,76 59.59,76 59.99,76.4 59.99,81.08 58.98,82.09 58.98,90.38 59.5,90.91 63.8,90.91 66.11,88.59 v70.92,88.59 | v83.52,88.8 83.52,87.44 IC2.1
  Bottom 0.203: v70.92,88.59 83.31,88.59 v83.52,88.8
CATH3
  Top 0.203: IC2.7 91.17,84.22 Q3.1
CATH4  (via drill 0.3)
  Top 0.203: IC2.5 88.64,88.67 90.22,90.25 93.67,90.25 94.49,89.44 v94.49,80.91 | v94.49,75.01 95.84,75.01 Q4.1
  Bottom 0.203: v94.49,80.91 v94.49,75.01
CATH5  (via drill 0.3)
  Top 0.203: IC2.6 89.91,89.12 90.63,89.85 93.27,89.85 93.88,89.24 93.88,81.11 v93.67,80.91 | v92.05,75.01 90.96,75.01 Q5.1
  Bottom 0.203: v93.67,80.91 93.67,76.64 v92.05,75.01
CATH_1
  Top 0.203: D11.C 8.04,62.5 | 18.02,61.36 18.09,61.16
  Top 0.356: 8.04,62.5 8.94,61.16 18.09,61.16 28.04,61.16 | 28.04,61.16 38,61.16 | 38,61.16 46.94,61.16 D15.C | D14.C 38.02,61.59 38,61.16 | D13.C 28.02,62.36 28.04,61.16 | D12.C 18.02,61.36 | D9.C 42.75,76.5 44.36,78.11 46.41,78.11 D10.C 51.62,80.1 Q1.3
  Bottom 0.356: D9.C D14.C
CATH_2
  Top 0.203: D6.C 8.02,76.51 | 18.02,77.57 18.09,77.62
  Top 0.356: 8.02,76.51 9.14,77.62 18.09,77.62 26.82,77.62 D8.C | D7.C 18.02,77.57 | D1.C 6.91,91.64 3.05,91.64 1.42,90.02 1.42,79.25 3.05,77.62 6.69,77.62 D6.C | D5.C 48.52,90 56.2,90 57.51,88.7 57.51,81.48 58,80.99 Q2.3
  Bottom 0.203: D2.C 18.13,90.5 | D3.C 28.09,90.5 | D4.C 38.04,90.5
  Bottom 0.356: D1.C 8.17,90.5 9.62,91.94 16.58,91.94 D2.C | 18.13,90.5 19.57,91.94 26.58,91.94 D3.C | 28.09,90.5 29.53,91.94 36.58,91.94 D4.C | 38.04,90.5 39.49,91.94 46.58,91.94 D5.C
CATH_3  (via drill 0.3)
  Top 0.203: DI1.P$3 DI1.P$8
  Top 0.356: Q3.3 92.6,80.45 93.16,79.89 110.02,79.89 111.65,78.26 v111.65,75.22
  Bottom 0.356: v111.65,75.22 111.65,71.06 DI1.P$3
CATH_4  (via drill 0.3)
  Top 0.356: DI2.P$8 DI2.P$3 119.46,69.44 118.15,70.75 112.87,70.75 v112.26,70.14 | Q4.3 105.02,74 105.87,73.15 105.87,70.51 106.88,69.49 106.88,68.4 v106.97,68.1
  Bottom 0.356: v112.26,70.14 112.26,68.71 111.65,68.1 v106.97,68.1
CATH_5  (via drill 0.3)
  Top 0.356: DI3.P$3 DI3.P$8 138.99,69.44 139.28,69.73 139.28,75.01 138.47,75.83 129.33,75.83 128.72,76.44 v112.46,76.44 | v105.55,75.83 93.67,75.83 93.07,75.22 93.07,74.03 Q5.3
  Bottom 0.356: v112.46,76.44 106.16,76.44 v105.55,75.83
CPU-RESET
  Top 0.203: U1.29 173.75,53.1 173.35,52.7 163.83,52.7 163.19,53.34 R44.1 160.44,58 J3.5
GND  (via drill 0.3, 0.3 pad 0.3, 0.9)
  Top 0.178: v98,42 C1.2
  Top 0.305: CN1.GND@1 65.28,86.91 v65.24,87.27
  Top 0.356: Q4.2 95.06,73.05 v94.77,72.76 v92.13,72.76 91.84,73.05 Q5.2 | C1.2 98.75,45.25 98.75,45.52 99,45.76 U2.6 99,52 98.21,52.79 U2.29 98.21,58.86 C2.2 97.54,59.74 v97.54,61.57 | Q1.2 54.95,76.76 v55.04,76.67 | Q2.2 58.95,76.76 v59.04,76.67 | CN1.GND@2 54.95,85.96 v54.73,84.21
  Top 0.406: v87.49,91.1 87.36,91.22 IC2.13 87.36,94.64 87,95 C11.2 | IC2.8 92.44,88.94 v92.16,89.07 | v76.2,91.03 76.36,91.15 IC1.13 76.36,94.64 76,95 C10.2 | Q3.2 90.4,80.24 v90.49,80.05 | C9.2 v66.45,81.08 | C8.2 v66.45,78.44
  Bottom 0.178: v100,20 v86,20 86,18 84,16 60,16 58,18 v58,20 v44,20 v30,20 30,18 28,16 18,16 16,18 v16,20 1,20 | v100,20 v114,20 114,18 116,16 126,16 128,18 v128,20 v142,20 v156,20 156,18 158,16 182,16 184,18 v184,20 199,20 | v100,20 100,40 v98,42
  Bottom 0.406: v76.2,91.03 76.31,90.99 | v87.49,91.1 87.58,91.1
  other vias: 82.5,87.39 97.54,60.96 191.77,88.9 191.77,50.8 65.23,79.86 61.24,89.98 55.14,91.06 73.14,70.06 12.77,71.7 103.63,71.32 61.24,87.64 63.88,89.87 176.35,57.22 176.32,58.86 170.4,58.1 164.85,58.04 166.37,56.52 181.9,57.4 180.3,56.1 188.63,54.9 188.63,65.8 146.05,57.88 146.05,80.01 146.05,73.66 146.05,68.58 174.05,74.01 172.05,76.01 180.05,72.01 183.05,74.01 154.05,92.01 157.05,92.01 100.58,68.88 106.07,68.88 99.97,61.57 106.68,61.57 82.5,85.95 89.52,85.61 92.36,85.61 76.81,96.33 86.56,85.34 86.97,84.53 84.52,73.52 70.7,83.68 11.36,49.74 57.69,49.74
  pour Top (isolate 0.75, rank 2, no thermals): 3,38 197,38 197,2 3,2
  pour Bottom: 0,22 3,22 3,18 0,18
  pour Bottom: 197,22 200,22 200,18 197,18
  pour Bottom: 0,100 200,100 200,45 140,45 140,59 60,59 60,45 0,45
  pour Top: 191.82,50.34 195.58,49.53 195.58,52.07 191.82,51.26
  pour Top (rank 3): 191.74,89.27 195.58,90.17 195.58,87.63 191.74,88.53
  pour Top (rank 2): 0,100 200,100 200,46 145,46 135,58 69,58 59,48 0,48
KEY1  (via drill 0.3)
  Top 0.203: SW1.2B 3.53,87.76 5.14,86.14 11.88,86.14 SW2.2B 13.5,87.75 15.3,85.94 21.68,85.94 SW3.2B 23.64,87.76 25.67,85.74 31.48,85.74 SW4.2B 33.6,87.76 35.42,85.94 41.68,85.94 SW5.2B | v39.01,57.51 45.72,57.51 50.42,62.34 | 50.42,62.34 52.62,64.62 v86.36,64.62 | U2.30 97.4,56.56 v97.33,56.69 | v95.5,64.62 v88.59,64.62 | R40.1 53.77,59 50.42,62.34
  Bottom 0.203: SW5.2B 43.46,87.76 41.66,85.95 41.66,63.4 38.61,60.35 38.61,57.91 v39.01,57.51 | v86.36,64.62 v88.59,64.62 | v97.33,56.69 97.33,58.32 96.11,59.54 96.11,64.01 v95.5,64.62
KEY2  (via drill 0.3)
  Top 0.203: SW6.2B 4.74,72.51 12.25,72.51 SW7.2B | SW8.2B 23.61,73.76 24.86,72.51 32.25,72.51 SW9.2B 33.56,73.76 34.81,72.51 42.25,72.51 SW10.2B 47.75,73.76 55.68,65.84 v56.5,65.84 58.93,65.84 | 58.93,65.84 v86.36,65.84 | U2.26 100.6,56.51 v100.58,56.69 | v96.93,65.84 v88.59,65.84 | R38.2 v56.5,63 | 58.93,65.84 58.93,73.76 59.94,74.78 62.18,74.78 63.4,76 69.5,76 ENC1.D
  Bottom 0.203: SW7.2B 13.5,73.71 15.3,71.9 21.64,71.9 SW8.2B | v86.36,65.84 v88.59,65.84 | v96.93,65.84 97.13,65.43 97.13,64.62 96.93,64.41 96.93,60.55 100.58,56.9 v100.58,56.69 | v56.5,63 v56.5,65.84
KEY3  (via drill 0.3)
  Top 0.203: SW11.2B 3.5,59.72 4.74,58.48 12.21,58.48 SW12.2B 13.61,59.76 14.9,58.48 22.21,58.48 SW13.2B 23.57,59.76 24.86,58.48 32.21,58.48 SW14.2B 33.53,59.76 34.81,58.48 42.21,58.48 SW15.2B | SW15.2B 43.5,59.75 | SW15.2B 46.96,59.76 52.5,65.25 v55,65.25 v85.75,65.23 | U2.27 99.79,56.71 v99.77,56.69 | v96.52,65.02 96.32,65.23 v89.2,65.23 | R39.2 v55,61
  Bottom 0.203: v85.75,65.23 v89.2,65.23 | v99.77,56.69 96.52,59.74 v96.52,65.02 | v55,61 v55,65.25
LATCH  (via drill 0.3)
  Top 0.203: IC1.12 77.64,95.72 78.44,96.52 87.78,96.52 88.59,95.71 88.59,92.64 IC2.12 88.59,92.56 v88.59,91.03 | v89.61,75.79 87.99,74.17 87.99,64.01 88.8,63.4 88.8,59.33 89.2,58.93 96.32,58.93 96.61,58.63 U2.31 | v89.41,80.06 89.41,81.89 89.61,82.09 91.24,82.09 91.44,82.3 91.44,83.31 93.27,85.14 v93.27,89
  Bottom 0.203: v89.61,75.79 89.61,79.86 v89.41,80.06 | v93.27,89 93.27,91.03 92.66,91.64 89.2,91.64 v88.59,91.03
N$1
  Top 0.178: R13.2 101.85,44.45 100.79,45.52 100.58,46.45 U2.8
N$2
  Top 0.178: U2.9 101.39,45.73 102.21,44.91 105.05,44.91 105.66,45.52 105.66,45.92 106.07,46.33 106.87,46.33 R14.2
N$3
  Top 0.178: U2.10 102.2,45.73 102.62,45.31 104.04,45.31 106.07,47.35 110.54,47.35 111.15,46.74 111.15,45.11 111.76,44.5 112.56,44.5 R15.2
N$4
  Top 0.178: U2.11 104.38,46.47 105.87,47.95 111.56,47.95 112.57,46.94 112.57,46.4 R16.2
N$5
  Top 0.178: 116.84,46.74 116.84,44.91 117.25,44.5 118.28,44.5 R17.2
  Top 0.203: 116.84,46.74 116.84,47.16 115.2,48.8 106.4,48.8 105.6,49.6 104.71,49.6 U2.14
N$6
  Top 0.203: R18.2 118.33,48.07 116.8,49.6 107.2,49.6 106.4,50.4 104.69,50.4 U2.15
N$7  (via drill 0.3)
  Top 0.178: 134.11,46.94 134.11,44.7 134.52,44.3 135.32,44.3 R23.2 | 108.92,54.4 108.92,54.86 v108.1,55.68 | v102.21,55.68 U2.24
  Top 0.203: 134.11,46.94 134.11,49.09 129.6,53.6 109.72,53.6 108.92,54.4
  Bottom 0.178: v108.1,55.68 v102.21,55.68
N$8
  Top 0.178: U2.19 105.83,53.68 106.07,53.44 106.07,52 | 122.53,46.74 122.53,44.91 123.14,44.3 123.89,44.3 R19.2
  Top 0.203: 122.53,46.74 122.53,47.07 119.2,50.4 107.67,50.4 106.07,52
N$9
  Top 0.178: U2.20 106.06,54.47 106.88,53.65 106.88,52.8
  Top 0.203: R20.2 124.04,47.96 120.8,51.2 108.48,51.2 106.88,52.8
N$10
  Top 0.178: U2.21 106.26,55.28 107.49,54.05 | 128.42,46.74 128.42,44.91 128.83,44.5 129.71,44.5 R21.2
  Top 0.203: 128.42,46.74 128.42,47.58 124,52 108.8,52 107.49,53.31 107.49,54.05
N$11
  Top 0.178: U2.22 106.69,56.07 108.31,54.46 108.31,53.6 | 129.64,46.47 R22.2
  Top 0.203: 129.64,46.47 129.64,49.56 126.4,52.8 109.11,52.8 108.31,53.6
N$12
  Top 0.203: U1.13 172.96,73.05 162,84 159.98,84 R41.1
N$13
  Top 0.203: U1.14 172.16,71.84 162,82 159.89,82 R42.1
N$14
  Top 0.203: U2.36 70.47,54.47 64.8,48.8 64.8,46.6 R1.2
N$15
  Top 0.203: U2.37 72.88,53.68 69.6,50.4 69.6,46.39 R2.2
N$16
  Top 0.178: R7.2 81.23,44.45 81.48,44.7 81.48,46.94 | 93.28,49.58 U2.42
  Top 0.203: 93.28,49.58 83.98,49.58 81.48,47.08 81.48,46.94
N$17
  Top 0.178: 93.28,48.77 U2.43
  Top 0.203: 93.28,48.77 86.37,48.77 85.6,48 85.6,46.45 R8.2
N$18
  Top 0.178: R9.2 86.51,44.45 86.77,44.7 86.77,46.74 | 93.32,48.16 U2.44
  Top 0.203: 93.32,48.16 88.16,48.16 86.77,46.77 86.77,46.74
N$19
  Top 0.178: R10.2 94.9,46.35 U2.1
N$20  (via drill 0.3)
  Top 0.178: 135.33,46.5 R24.2 | v101.4,54.86 U2.25
  Top 0.203: v109.53,54.86 131.54,54.86 136,50.4 136,46.88 R24.2
  Bottom 0.178: v109.53,54.86 v101.4,54.86
N$21
  Top 0.203: R41.2 R42.2 154.44,81.92 C12.1
N$22  (via drill 0.3)
  Top 0.203: U2.18 100.14,52.87 v99.77,53.24 | R33.2 93.51,60.51 J1.1
  Bottom 0.203: v99.77,53.24 97.94,53.24 95.1,56.08 95.1,61.98 J1.1
N$23
  Top 0.178: R12.2 96.27,44.45 96.72,44.91 96.72,46.36 U2.3
N$24
  Top 0.178: R11.2 91.39,44.45 92.25,45.31 95.5,45.31 95.71,45.52 95.71,46.37 U2.2
N$25
  Top 0.178: 93.3,50.39 U2.41
  Top 0.203: 93.3,50.39 81.59,50.39 80,48.8 R6.2
N$26
  Top 0.178: R5.2 75.74,44.45 76,44.7 76,46.94 | 93.3,51.21 U2.40
  Top 0.203: 93.3,51.21 79.21,51.21 76,48 76,46.94
N$27
  Top 0.203: U2.39 76.88,52.08 74.4,49.6 74.4,46.67 R4.2
N$28
  Top 0.178: R3.2 70.46,44.45 70.71,44.7 70.71,46.94 | 90.63,52.83 93.35,52.83 U2.38
  Top 0.203: 90.63,52.83 75.23,52.83 70.71,48.31 70.71,46.94
N$29
  Top 0.203: U$2.P2 U$2.P3 U$2.P4 145.15,87.95 C13.1 | C13.1 156.74,87.95 R43.2 | C12.2 C13.1
N$30
  Top 0.203: U1.7 183.42,60.42 184.78,59.05 XTAL1.P2 188.38,57.88 C3.2
N$31
  Top 0.203: IC1.9 81.44,90.87 81.89,90.42 85.75,90.42 86.16,90.83 86.16,92.54 IC2.14
N$32
  Top 0.203: U1.8 183.24,61.22 XTAL1.P1 188.38,62.77 C4.2
N$33
  Top 0.61: BA1.POS 136.49,93.99 137.19,94.69 SW16.COM
N$34
  Top 0.203: R34.1 D16.C
PAD1
  Top 0.178: R1.1 60.33,46.35 59.69,45.72 46.35,45.72 45.09,44.45 33.66,44.45 31.75,42.55 17.78,42.55 15.24,40.01 8.51,40.01 P1.P$1
  pour Top: 3,2 15,2 15,19 8,19 8,38 3,38
PAD2
  Top 0.178: P2.P$1 18.59,37 22.86,41.27 33.02,41.27 34.92,43.18 45.72,43.18 46.99,44.45 60.33,44.45 60.96,45.09 66.26,45.09 R2.1
  pour Top: 10,38 10,21 22,21 22,38
PAD3  (via drill 0.3)
  Top 0.178: v23,18.75 P3.P$1 | v23,39.25 23.38,39.25 24.13,40.01 34.29,40.01 36.2,41.91 46.35,41.91 47.62,43.18 60.33,43.18 61.59,44.45 R3.1
  Bottom 0.178: v23,39.25 v23,18.75
  pour Top: 17,2 29,2 29,19 17,19
PAD4
  Top 0.178: P4.P$1 33.19,37 36.83,40.64 46.99,40.64 48.26,41.91 60.96,41.91 62.23,43.18 70.36,43.18 71.37,44.2 71.37,45.47 72.01,46.1 72.35,46.1 R4.1
  pour Top: 24,38 24,21 36,21 36,38
PAD5
  Top 0.178: P5.P$1 40.81,37 43.18,39.37 47.62,39.37 48.9,40.64 61.59,40.64 62.87,41.91 71.75,41.91 72.39,42.55 72.39,44.23 R5.1
  pour Top: 38,38 38,19 31,19 31,2 43,2 43,38
PAD6
  Top 0.178: P6.P$1 47.5,37.34 49.53,39.37 61.59,39.37 63.5,41.27 73.91,41.27 76.58,43.94 76.58,45.05 R6.1
  pour Top: 45,38 50,38 50,19 57,19 57,2 45,2
PAD7
  Top 0.178: 56.52,36.83 57.83,36.83 P7.P$1 61.77,37 63.5,38.73 63.5,40.01 64.14,40.64 74.93,40.64 77.47,43.18 77.47,44.03 R7.1
  pour Top: 52,38 52,21 64,21 64,38
PAD8  (via drill 0.3)
  Top 0.178: v65,18.75 P8.P$1 | v65,39.25 75.44,39.25 77.47,41.27 80.01,41.27 82.17,43.43 82.17,45.72 82.8,46.35 R8.1
  Bottom 0.178: v65,39.25 v65,18.75
  pour Top: 59,19 59,2 71,2 71,19
PAD9
  Top 0.178: P9.P$1 74.47,37 78.11,40.64 81.28,40.64 83.19,42.55 83.19,44.23 R9.1
  pour Top: 66,38 66,21 78,21 78,38
PAD10  (via drill 0.3)
  Top 0.178: v79,18.75 P10.P$1 | R10.1 88.14,46.35 87.25,45.47 87.25,43.43 83.57,39.75 79.58,39.75 v79.05,39.22
  Bottom 0.178: 79,39.25 v79,18.75
  Bottom 0.203: v79.05,39.22 79.05,39.3 79,39.25
  pour Top: 73,2 73,19 85,19 85,2
PAD11
  Top 0.178: R11.1 88.48,37.68 88.27,37.47 86.97,37.47 P11.P$1
  pour Top: 80,21 92,21 92,38 80,38
PAD12
  Top 0.178: R12.1 93.56,41.69 96.52,38.73 96.52,36.98 | 96.52,36.2 96.52,36.98 | 96.52,36.98 P12.P$1
  pour Top: 87,2 99,2 99,38 94,38 94,19 87,19
PAD13
  Top 0.178: R13.1 109,42.96 105.41,39.37 105.41,37.47 103.97,37.47 P13.P$1
  pour Top: 101,2 113,2 113,19 106,19 106,38 101,38
PAD14
  Top 0.178: R14.1 109.22,46.35 110.49,45.09 110.49,37.47 111.12,36.83 113.83,36.83 P14.P$1
  pour Top: 108,38 108,21 120,21 120,38
PAD15  (via drill 0.3)
  Top 0.178: v121,18.75 P15.P$1 | R15.1 114.72,42.13 117.59,39.25 v121,39.25
  Bottom 0.178: v121,39.25 v121,18.75
  pour Top: 115,2 127,2 127,19 115,19
PAD16
  Top 0.178: R16.1 114.94,46.35 116.2,45.09 116.2,43.18 118.11,41.27 120.02,41.27 123.83,37.47 127.53,37.47 P16.P$1
  pour Top: 122,38 122,21 134,21 134,38
PAD17
  Top 0.178: R17.1 120.43,42.76 123.83,39.37 135.25,39.37 137.16,37.47 138.03,37.47 P17.P$1
  pour Top: 136,38 136,19 129,19 129,2 141,2 141,38
PAD18
  Top 0.178: R18.1 121.28,46.35 121.92,45.72 121.92,43.81 125.73,40.01 135.89,40.01 136.53,39.37 142.24,39.37 144.15,37.47 145.03,37.47 P18.P$1
  pour Top: 143,38 148,38 148,19 155,19 155,2 143,2
PAD19
  Top 0.178: R19.1 126.15,42.76 128.27,40.64 137.16,40.64 137.79,40.01 148.59,40.01 151.13,37.47 155.53,37.47 P19.P$1
  pour Top: 150,38 150,21 162,21 162,38
PAD20  (via drill 0.3)
  Top 0.178: v163,18.75 P20.P$1 | R20.1 127,46.35 127.64,45.72 127.64,43.18 128.91,41.91 137.16,41.91 138.43,40.64 149.86,40.64 151.13,39.37 162.88,39.37 v163,39.25
  Bottom 0.178: v163,39.25 v163,18.75
  pour Top: 157,19 157,2 169,2 169,19
PAD21
  Top 0.178: R21.1 131.86,43.4 132.72,42.55 138.43,42.55 139.7,41.27 151.13,41.27 151.76,40.64 163.83,40.64 168.28,36.2 169.69,36.2 P21.P$1
  pour Top: 164,38 164,21 176,21 176,38
PAD22  (via drill 0.3)
  Top 0.178: v177,18.75 P22.P$1 | R22.1 132.72,46.35 133.35,45.72 133.35,43.81 133.99,43.18 139.7,43.18 140.97,41.91 165.1,41.91 167.64,39.37 176.88,39.37 v177,39.25
  Bottom 0.178: v177,39.25 v177,18.75
  pour Top: 171,2 171,19 183,19 183,2
PAD23
  Top 0.178: R23.1 139.7,44.45 141.6,42.55 167,42.55 168.91,40.64 177.8,40.64 179.71,38.73 179.71,37.47 180.34,36.83 184.33,36.83 P23.P$1
  pour Top: 178,21 190,21 190,38 178,38
PAD24
  Top 0.178: R24.1 139.7,46.35 142.88,43.18 168.91,43.18 170.18,41.91 179.07,41.91 180.97,40.01 191.13,40.01 193.04,38.1 193.04,36.83 194.33,36.83 P24.P$1
  pour Top: 185,2 197,2 197,38 192,38 192,19 185,19
QUAD1
  Top 0.203: U2.35 92.45,55.28 89.61,58.12 71.73,58.12 71.12,58.73 71.12,59.93 R37.1 71.12,60.07 71.12,60.76 70.5,61.38 ENC1.A
QUAD2
  Top 0.203: U2.32 95.8,56.58 95.71,56.49 94.49,56.49 94.28,56.69 94.28,58.12 93.88,58.52 75.59,58.52 74.98,59.13 74.98,59.97 R36.1 74.98,60.03 74.98,60.55 75.5,61.07 ENC1.B
SCLK  (via drill 0.3)
  Top 0.203: IC1.11 78.91,90.56 79.45,90.02 87.99,90.02 | 87.99,90.02 88.8,90.02 89.81,91.03 89.81,92.51 IC2.11 | U2.16 100.9,51.29 v100.79,51.41 | J1.5 84.88,61.91 86.97,64.01 86.97,75.18 v87.58,75.79 | v87.78,80.06 87.78,84.53 v87.99,84.73 | v87.99,89.2 87.99,90.02
  Bottom 0.203: v100.79,51.41 98.55,51.41 91.85,58.12 87.58,58.12 84.94,60.76 84.94,61.98 J1.5 | v87.58,75.79 87.58,79.86 v87.78,80.06 | v87.99,84.73 v87.99,89.2
SD-CK  (via drill 0.3, 0.9)
  Top 0.203: CN1.5 64.2,82.71 64.41,82.5 66.04,82.5 66.85,81.69 70.51,81.69 71.12,81.08 71.12,79.65 73.56,77.22 73.56,73.15 73.76,72.95 81.48,72.95 82.5,71.93 82.5,68.07 82.91,67.67 v85.55,67.67 | v89.2,67.67 98.75,67.67 100.58,65.84 105.16,65.84 109.43,61.57 138.79,61.57 139.6,62.38 v139.6,65.43 | v141.43,65.43 141.43,67.46 142.65,68.68 142.65,70.51 143.26,71.12 v146.05,71.12 150.5,71.12 151.13,70.48 151.13,58.42 151.76,57.78 155.57,57.78 156.21,58.42 J3.3 156.84,59.69 158.12,60.96 161.29,60.96 161.55,61.22 U1.17
  Bottom 0.203: v85.55,67.67 v89.2,67.67 | v139.6,65.43 v141.43,65.43
  pour Top: 146,71.58 142.24,72.39 142.24,69.85 146,70.66
SD-CS  (via drill 0.3, 0.9)
  Top 0.203: CN1.2 60.9,82.56 61.57,81.89 61.57,77.42 62.38,76.61 66.65,76.61 68.48,78.44 71.12,78.44 72.75,76.81 72.75,72.75 73.36,72.14 81.08,72.14 81.69,71.53 81.69,67.06 82.3,66.45 v85.75,66.45 | v89.2,66.45 97.54,66.45 99.36,64.62 105.16,64.62 109.02,60.76 138.59,60.76 v138.84,60.5 | U1.23 167.57,56.42 166.37,55.24 v163.83,55.24 | v162.56,55.24 151.76,55.24 v146.05,60.96
  Bottom 0.203: v85.75,66.45 v89.2,66.45 | v138.84,60.5 145.59,60.5 v146.05,60.96 | v163.83,55.24 v162.56,55.24
  pour Top: 146,61.42 142.24,62.23 142.24,59.69 146,60.5
SD-DI  (via drill 0.3, 0.9)
  Top 0.203: CN1.3 62,77.6 62.59,77.01 66.45,77.01 68.28,78.84 71.32,78.84 73.15,77.01 73.15,72.95 73.56,72.54 81.28,72.54 82.09,71.73 82.09,67.67 82.7,67.06 v86.36,67.06 | v88.59,67.06 98.15,67.06 99.97,65.23 105.16,65.23 109.23,61.16 139.46,61.16 v139.55,61.25 | v141.25,61.25 141.25,63.63 143.66,66.04 v146.05,66.04 v150.5,66.04 | J3.4 156.21,63.5 157.48,64.77 | 157.48,64.77 170.81,64.77 171.35,64.23 U1.15 | v152.4,66.04 156.21,66.04 157.48,64.77
  Bottom 0.203: v86.36,67.06 v88.59,67.06 | v139.55,61.25 v141.25,61.25 | v150.5,66.04 v152.4,66.04
  pour Top: 146,66.5 142.24,67.31 142.24,64.77 146,65.58
SD-DO  (via drill 0.3, 0.9)
  Top 0.203: CN1.7 66.4,82.75 67.06,82.09 70.71,82.09 71.53,81.28 71.53,79.86 73.97,77.42 73.97,73.76 74.37,73.36 81.69,73.36 82.91,72.14 82.91,68.68 83.31,68.28 v86.36,68.28 | v88.59,68.28 99.36,68.28 101.19,66.45 105.16,66.45 109.63,61.98 138.38,61.98 138.99,62.59 138.99,67.87 v139.6,68.48 | v141.43,68.48 141.43,75.59 142.24,76.4 145.85,76.4 v146.05,76.2 150.5,76.2 151.76,74.93 151.76,60.33 152.4,59.69 J3.1 154.94,60.96 156.84,60.96 157.48,61.59 157.48,63.5 158.12,64.14 170.18,64.14 170.56,63.76 U1.16
  Bottom 0.203: v86.36,68.28 v88.59,68.28 | v139.6,68.48 v141.43,68.48
  pour Top: 146,76.66 142.24,77.47 142.24,74.93 146,75.74
SDA  (via drill 0.3)
  Top 0.203: U2.17 100.93,52.08 v100.79,52.22 | J1.4 87.42,74.61 v88.59,75.79 | v88.59,80.06 88.59,85.14 88.19,85.55 87.38,85.55 86.77,86.16 86.77,89 86.36,89.41 76.2,89.41 74.98,90.63 74.98,92.49 IC1.14
  Bottom 0.203: v100.79,52.22 98.35,52.22 92.05,58.52 88.19,58.52 87.38,59.33 87.38,62 J1.4 | v88.59,75.79 v88.59,80.06
SEG_A  (via drill 0.3)
  Top 0.203: DI3.P$10 135.75,74.52 134.48,73.25 129.72,73.25 128.44,74.52 DI2.P$10 125.27,74.52 124,73.25 119.56,73.25 118.28,74.52 DI1.P$10 112.78,74.52 111.44,73.18 109.62,73.18 108.8,74 108.8,78.3 108.19,78.91 85.47,78.91 v84.77,79.61 R25.2 | D2.A 15.48,91.48 17.68,93.67 51.61,93.67 v51.82,93.47 66.24,93.47 69.29,90.42 v69.29,89.81
  Bottom 0.203: v51.82,93.47 51.82,82.7 45.68,76.5 D10.A | v69.29,89.81 69.29,88.39 70.1,87.58 78.13,87.58 R25.2 v84.77,79.61 | SW15.1B 41.66,57.08 41.66,62.59 43.5,64.43 SW10.1B 45.48,71.22 D10.A | SW5.1B 45.48,81.26 D10.A
SEG_B  (via drill 0.3)
  Top 0.203: DI3.P$9 135.75,71.98 134.48,70.71 129.72,70.71 128.44,71.98 DI2.P$9 126.54,71.98 125.27,70.71 119.24,70.71 117.97,71.98 DI1.P$9 112.48,71.98 111.24,70.75 109.21,70.75 107.99,71.97 107.99,77.48 107.38,78.09 84.67,78.09 83.92,78.84 82.3,78.84 81.69,79.45 80.92,79.45 v80.77,79.61 R26.2 | v67.46,89.81 66.85,89.81 64.67,92 46.98,92 D5.A
  Bottom 0.203: D5.A 44.48,89.5 39.49,89.5 35.22,85.74 28.92,85.74 26.82,83.64 26.82,63.8 25.52,62.5 D13.A | v67.46,89.81 67.46,89 69.7,86.77 77.62,86.77 80.67,83.72 80.67,79.7 v80.77,79.61
SEG_C  (via drill 0.3)
  Top 0.203: DI3.P$7 135.11,66.9 133.84,65.63 129.4,65.63 128.13,66.9 DI2.P$7 124,66.9 122.73,65.63 119.56,65.63 118.28,66.9 DI1.P$7 115.12,66.9 113.88,65.67 109.41,65.67 108.4,66.68 108.4,70.14 107.18,71.36 107.18,76.67 106.57,77.28 84.26,77.28 83.52,78.03 81.69,78.03 81.28,78.44 80.26,78.44 79.86,78.84 78.44,78.84 77.83,79.45 76.92,79.45 v76.77,79.61 R27.2 | v55.88,89.2 52.43,89.2 51.61,88.39 51.61,85.34 51.19,84.92 25.18,84.92 SW3.1B
  Bottom 0.203: v55.88,89.2 66.04,89.2 69.29,85.95 75.79,85.95 76.61,85.14 76.61,79.77 v76.77,79.61 | SW13.1B 23.5,55.34 21.74,57.1 21.74,67.48 SW8.1B 25.26,71.34 25.48,71.56 D8.A 25.48,81.26 SW3.1B
SEG_D  (via drill 0.3)
  Top 0.203: DI3.P$5 129.72,64.36 128.44,65.63 124.64,65.63 123.36,64.36 DI2.P$5 119.56,64.36 118.28,65.63 116.06,65.63 114.79,64.36 DI1.P$5 109.91,64.36 107.99,66.28 107.99,69.93 106.77,71.15 106.77,76.47 106.36,76.87 84.06,76.87 83.31,77.62 81.48,77.62 81.08,78.03 80.06,78.03 79.65,78.44 78.23,78.44 77.83,78.84 76.61,78.84 76,79.45 74.92,79.45 v74.77,79.61 R28.2 | D6.A 3.33,76.5 1.49,74.65 1.49,64.99 2.5,64.18 33.8,64.18 D14.A 36.78,63.8 38.81,63.8 40.84,61.98 v44.09,61.98
  Bottom 0.203: v74.77,79.61 74.77,84.95 74.17,85.55 69.09,85.55 65.84,88.8 56.49,88.8 56.29,88.59 53.03,88.59 52.22,87.78 52.22,82.3 46.74,76.81 46.74,65.43 44.09,62.79 v44.09,61.98 | SW4.1B 33.5,76.59 31.76,74.86 31.76,70.97 SW9.1B 31.7,67.64 31.7,62.5 | SW14.1B 33.5,55.3 31.7,57.1 31.7,62.5 | 31.7,62.5 D14.A
SEG_E  (via drill 0.3)
  Top 0.203: DI3.P$2 129.72,71.98 128.44,73.25 125.59,73.25 124.32,71.98 DI2.P$2 119.56,71.98 118.28,73.25 112.38,73.25 111.11,71.98 DI1.P$2 109.8,71.98 108.4,73.39 108.4,77.89 107.79,78.5 84.87,78.5 83.92,79.45 82.92,79.45 v82.77,79.61 R29.2 | v68.28,89.81 68.28,90.63 66.04,92.86 27.84,92.86 D3.A
  Bottom 0.203: D3.A 24.28,89.5 19.37,89.5 14.7,85.53 9.21,85.53 6.92,83.24 6.92,63.94 D11.A 5.4,62.5 4.27,61.37 | v68.28,89.81 68.28,88.8 69.9,87.17 77.83,87.17 82.7,82.3 82.7,79.67 v82.77,79.61 | SW1.1B 3.5,76.46 1.69,74.65 1.69,71.05 SW6.1B 3.45,69.19 3.45,62.18 4.27,61.37 | SW11.1B 3.5,55.31 5.49,57.3 5.49,60.15 4.27,61.37
SEG_F  (via drill 0.3)
  Top 0.203: DI3.P$1 129.72,74.52 128.44,75.79 124.32,75.79 123.05,74.52 DI2.P$1 119.56,74.52 118.28,75.79 113.12,75.79 111.85,74.52 DI1.P$1 110.03,78.29 109.01,79.31 86.25,79.31 v85.75,79.81 85.79,79.86 86.56,79.86 86.77,80.06 R30.2 | D9.A 32.72,79.05 2.44,79.05 2.03,79.45 2.03,89.81 2.72,90.5 D1.A 6.57,89.41 8.74,89.41 18.09,98.75 55.68,98.75 56.49,97.94 56.49,94.49 57.1,93.88 66.65,93.88 70.31,90.22 v70.31,89.81
  Bottom 0.203: v85.75,79.81 85.75,80.88 78.44,87.99 70.51,87.99 70.31,88.19 v70.31,89.81
SEG_G  (via drill 0.3)
  Top 0.203: DI3.P$6 135.11,64.36 133.84,63.09 129.72,63.09 128.44,64.36 DI2.P$6 125.27,64.36 124,63.09 119.56,63.09 118.28,64.36 DI1.P$6 116.23,64.36 115.1,63.23 109.21,63.23 109.01,63.43 109.01,64.65 107.58,66.07 107.58,69.73 106.36,70.95 106.36,76.06 105.96,76.47 83.86,76.47 83.11,77.22 81.28,77.22 80.87,77.62 79.86,77.62 79.45,78.03 78.03,78.03 77.62,78.44 76.4,78.44 76,78.84 75.5,78.84 | R31.2 v72.77,79.61 72.92,79.45 73.97,79.45 74.57,78.84 75.5,78.84 | D7.A 15.48,67.63 17.48,65.63 42.35,65.63 D15.A | ENC1.E 75.5,78.84
  Bottom 0.203: v72.77,79.61 72.77,84.51 72.14,85.14 68.89,85.14 65.63,88.39 56.69,88.39 56.49,88.19 53.24,88.19 52.63,87.58 52.63,81.08 49.17,77.62 49.17,74.98 47.55,73.36 47.55,64.57 D15.A
SEG_P  (via drill 0.3)
  Top 0.203: DI3.P$4 129.72,66.9 128.44,68.17 123.05,68.17 121.78,66.9 DI2.P$4 119.56,66.9 118.28,68.17 114.47,68.17 113.2,66.9 DI1.P$4 109.19,66.9 108.8,67.29 108.8,70.54 107.58,71.76 107.58,77.08 106.97,77.69 84.47,77.69 83.72,78.44 81.89,78.44 81.48,78.84 80.47,78.84 79.86,79.45 78.92,79.45 v78.77,79.61 R32.2 | v66.45,91.44 65.43,92.46 37.44,92.46 D4.A
  Bottom 0.203: D4.A 34.44,89.5 29.33,89.5 24.45,85.13 18.07,85.13 14.83,81.89 | 14.83,81.89 11.79,78.84 11.79,70.95 SW7.1B 13.5,64.48 D12.A 15.48,57.28 13.44,55.24 | v66.45,91.44 66.45,89.41 69.49,86.36 77.42,86.36 78.64,85.14 78.64,79.74 v78.77,79.61 | SW2.1B 13.5,83.22 14.83,81.89
  Bottom 0.254: 13.44,55.24 SW12.1B
SEGA
  Top 0.203: IC1.6 78.91,85.95 79.86,85 80.87,85 81.28,84.59 82.7,84.59 83.11,84.19 84.53,84.19 84.73,83.99 84.73,83.08 R25.1
SEGB
  Top 0.203: IC1.4 76.36,86.06 77.83,84.59 78.64,84.59 79.05,84.19 80.47,84.19 80.67,83.99 80.67,83.15 R26.1
SEGC
  Top 0.203: IC1.2 73.83,85.95 75.59,84.19 76.4,84.19 76.81,83.78 76.81,83.1 R27.1
SEGD
  Top 0.203: R28.1 74.78,83.06 74.78,83.99 72.54,86.22 72.54,87.39 IC1.1
SEGE
  Top 0.203: R29.1 82.7,83.11 82.7,83.99 82.5,84.19 81.08,84.19 80.67,84.59 79.25,84.59 77.62,86.22 77.62,87.39 IC1.5
SEGF
  Top 0.203: IC1.7 80.17,86.31 81.48,85 82.91,85 83.31,84.59 84.73,84.59 85.14,84.19 86.36,84.19 86.56,83.99 86.56,83.25 R30.1
SEGG
  Top 0.203: R31.1 72.77,85.19 71.73,86.22 71.73,89.47 72.14,89.88 73.36,89.88 73.76,90.28 73.76,92.54 IC1.15
SEGP
  Top 0.203: IC1.3 75.09,85.7 76,84.8 76.61,84.8 77.22,84.19 78.23,84.19 78.64,83.78 78.64,83.18 R32.1
TOUCH-RX  (via drill 0.3, 0.9)
  Top 0.203: U2.5 98.21,51.55 97.54,52.22 v97.54,55.27 | v146.05,50.8 174.62,50.8 175.35,51.53 U1.31
  Bottom 0.203: v97.54,55.27 100.79,55.27 102.21,56.69 103.23,56.69 105.66,59.13 138.38,59.13 140,57.51 140,52.02 141.22,50.8 v146.05,50.8
  pour Top: 142.24,52.07 146,51.26 146,50.34 142.24,49.53
TOUCH-TX  (via drill 0.3, 0.9)
  Top 0.203: U2.4 97.4,51.55 96.93,52.02 v96.93,55.88 | v146.05,55.88 147.32,55.88 151.76,51.44 173.99,51.44 174.56,52 U1.30
  Bottom 0.203: v96.93,55.88 100.79,55.88 102.01,57.1 103.02,57.1 105.46,59.54 138.58,59.54 140.41,57.71 140.41,56.69 141.22,55.88 v146.05,55.88
  pour Top: 142.24,57.15 146,56.34 146,55.42 142.24,54.61
VCC-CPU  (via drill 0.3, 0.9)
  Top 0.203: C5.1 163.73,60.01 R44.2 162.14,60.11 v161.93,60.33
  Top 0.356: U1.4 178.67,58.02 179.07,58.42 179.07,59.62 | 179.07,59.62 U1.6 177.58,59.69 175.9,59.69 | 179.07,59.62 180.09,59.62 C7.1 | C5.1 166.69,60.33 168.97,60.33 U1.18 170.09,60.42 170.81,59.69 175.9,59.69 | v154.94,93.98 175.9,93.98 177.16,92.71 177.16,82 | 177.16,82 177.16,62.23 175.9,60.96 175.9,59.69 | C15.+ 177.79,81.38 177.16,82
  Top 0.61: L3.2 142.04,95.52 143.65,97.13 154.84,97.13 154.84,94.08 v154.94,93.98
  Bottom 0.203: v161.93,60.33 160.66,60.33 160.02,60.96 154.94,60.96 J3.2
  pour Top: 154.48,94.03 153.67,97.79 156.21,97.79 155.4,94.03
VCC-TOUCH  (via drill 0.3)
  Top 0.203: R40.2 R39.1 | R39.1 R38.1 | R39.1 68.78,61 68.95,61.16 | 77.01,64.01 77.01,60.04 R36.2 | 77.01,64.01 v85.75,64.01 | v89.2,64.01 91.64,64.01 92.46,63.2 92.46,62.79 92.85,62.39 | R37.2 68.95,61.16 | 68.95,61.16 68.95,63.46 69.49,64.01 77.01,64.01 | R33.1 91.4,60.95 J1.2
  Top 0.356: C1.1 99.79,44.62 U2.7 99.79,52.21 99,53 U2.28 99,59.22 C2.1 | J1.2 92.85,62.39 93.86,63.4 96.72,63.4 98.35,61.77 98.35,61.16 98.96,60.55 98.96,60.01 C2.1 | C2.1 103.6,59.59 | 103.6,59.59 104.78,58.42 L1.2 | C16.+ 103.63,59.63 103.6,59.59
  Top 0.406: 99.79,44.58 C1.1
  Bottom 0.203: v85.75,64.01 v89.2,64.01
VCC-UI  (via drill 0.3, 0.3 pad 0.3)
  Top 0.356: L2.1 91.17,94.72 IC2.10
  Top 0.406: v72.54,90.89 72.56,90.91 IC1.16 72.56,94.5 C10.1 | v80.26,91.1 80.26,92.51 IC1.10 | IC2.10 91.17,91.16 v91.24,90.89 | v83.56,91.14 IC2.16 83.56,94.5 C11.1
  Top 0.61: C17.+ 68.66,72.52 v71.73,75.59
  Bottom 0.254: 83.52,91.1 83.56,91.1 v83.56,91.14
  Bottom 0.61: v72.54,90.89 73.34,90.08 79.25,90.08 v80.26,91.1 83.52,91.1 | 85.55,90.22 85.55,82.09 86.56,81.08 86.56,79.25 85.75,78.44 74.37,78.44 71.63,75.69 | v91.24,90.89 91.24,90.83 90.63,90.22 85.55,90.22 | 85.55,90.22 84.47,90.22 v83.56,91.14 | 71.63,75.69 71.32,75.39 v71.32,75.18 | v71.73,75.59 71.63,75.69

### Text on the board
tPlace: 3.3 | Rev1 | gnd | + | B | C | A | D | E | do | - | ck | - | + | - | G | I | J | di | F | H | + | cs | --> | tx/rx | K | L | M | N | O | gnd | <-- | PIC18F44K22
Measures: Foobar | Foobar | Foobar